# EAGLE schematic axiom_beta_power_board_v0.37_r1.3.ba23fa1e (EAGLE 7.7.0)
Assembly variants: Beta, Min, Tele

## Sheet 1 of 10
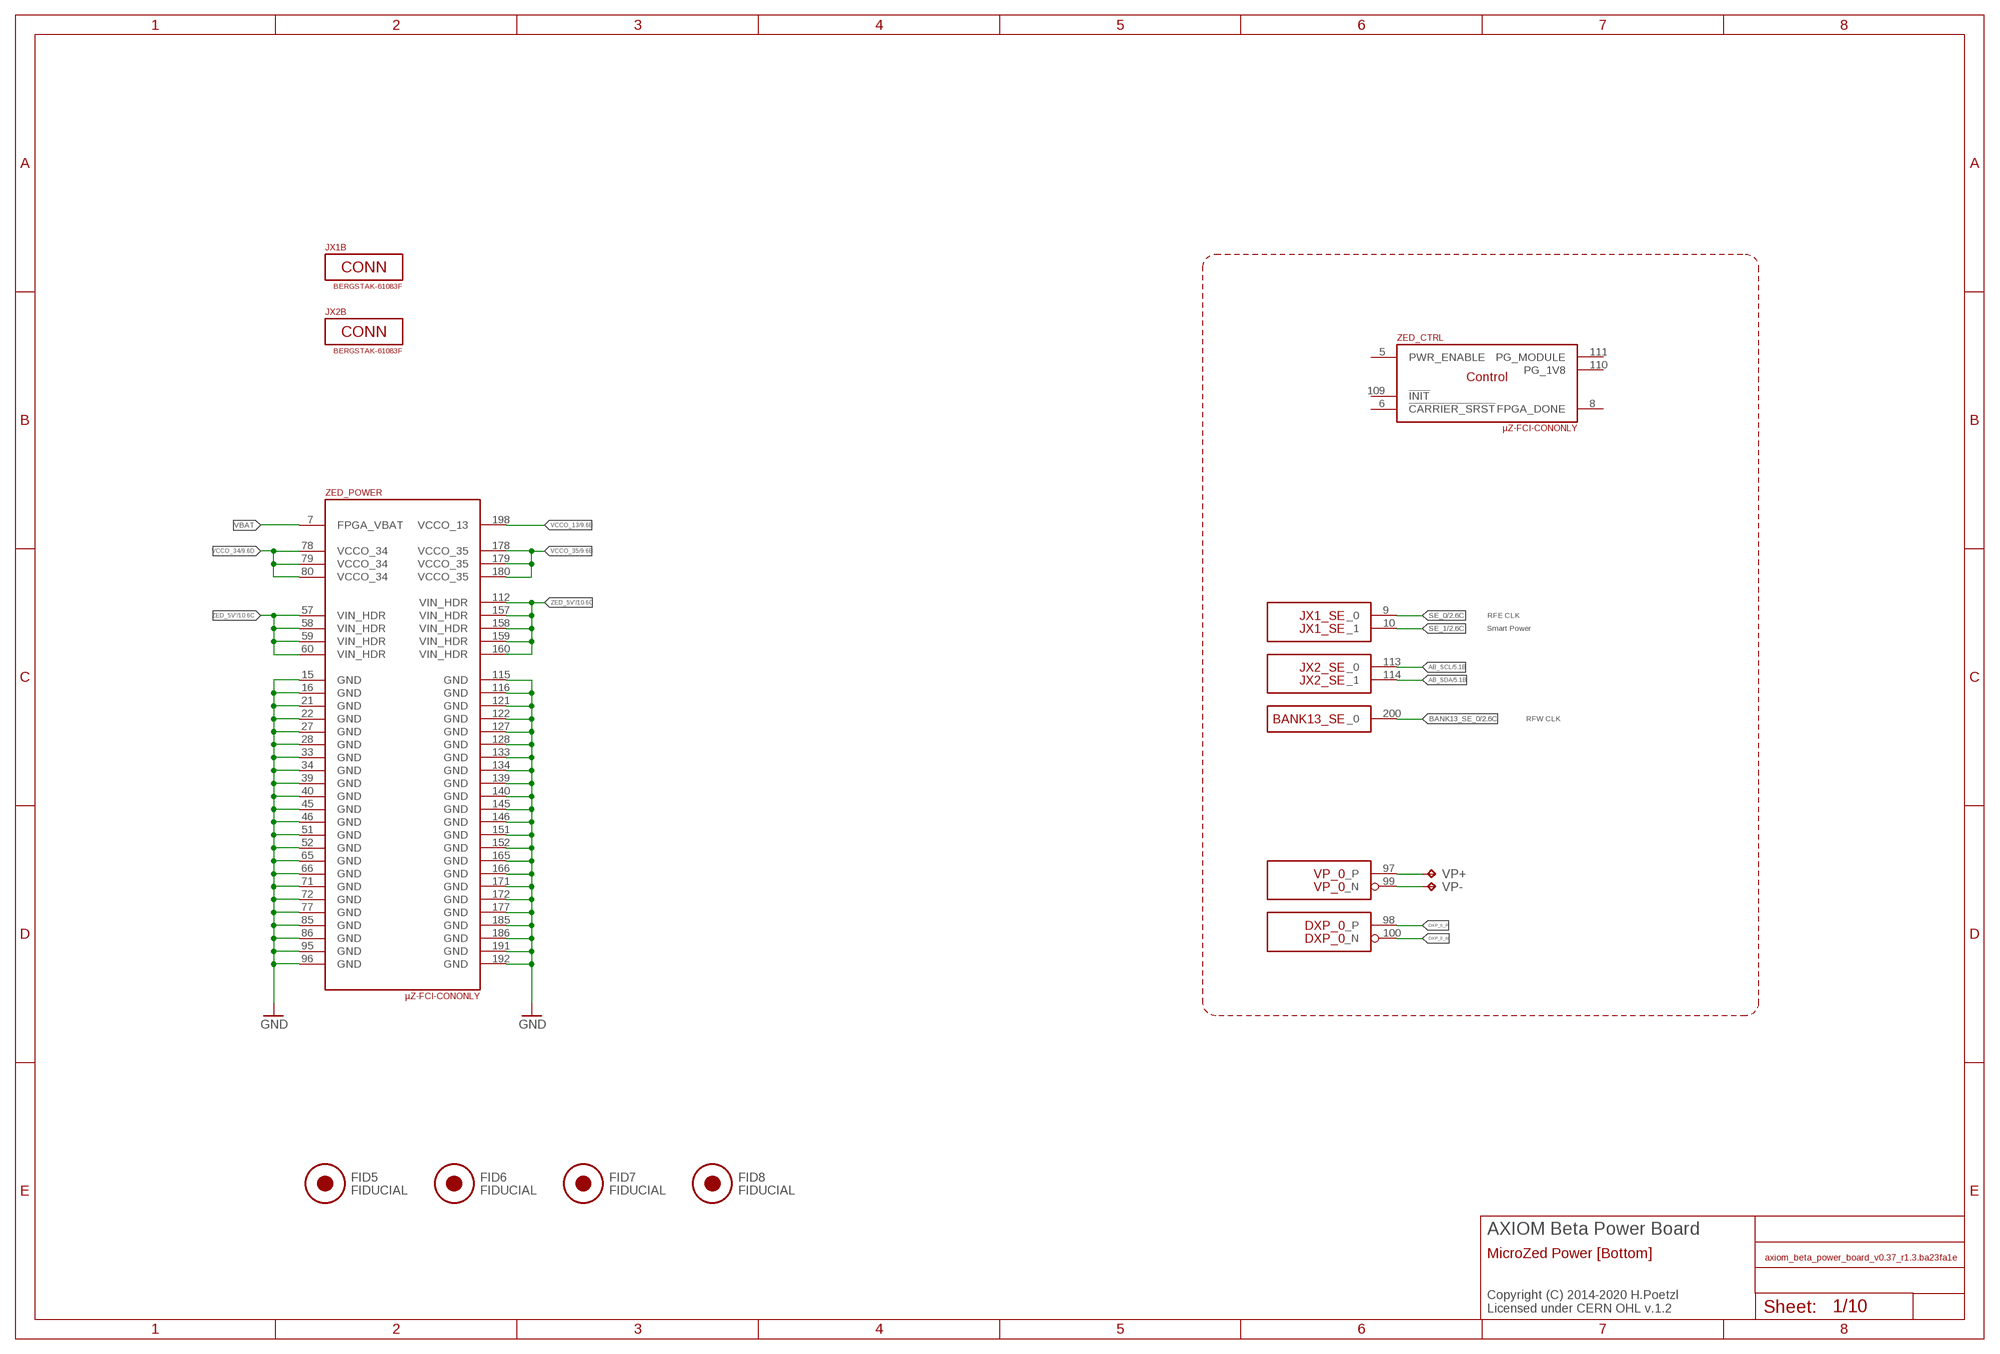
[diagram p0: schematic, sheet 1]

### Parts
FID5  FIDUCIAL  [FID_ARROW]  (not fitted in variant Tele)
FID6  FIDUCIAL  [FID_ARROW]  (not fitted in variant Tele)
FID7  FIDUCIAL  [FID_ARROW]  (not fitted in variant Tele)
FID8  FIDUCIAL  [FID_ARROW]  (not fitted in variant Tele)
JX1B  BERGSTAK-61083F  [61083-FAKE]  (not fitted in variant Beta)  (not fitted in variant Min)
JX2B  BERGSTAK-61083F  [61083-FAKE]  (not fitted in variant Beta)  (not fitted in variant Min)
VP+  TPTP16SQ  [TP16SQ]  (not fitted in variant Tele)
VP-  TPTP16SQ  [TP16SQ]  (not fitted in variant Tele)
ZED  µZ-FCI-CONONLY  [µZ-CONONLY]  (not fitted in variant Tele)

### Nets
AB_SCL: ZED.113(JX2_SE:_0) ; also sheet 5
AB_SDA: ZED.114(JX2_SE:_1) ; also sheet 5
BANK13_SE_0: ZED.200(BANK13_SE:_0) ; also sheet 2
DXP_0_N: ZED.100(DXP_0:_N)
DXP_0_P: ZED.98(DXP_0:_P)
GND: ZED.15(_POWER:GND) ZED.16(_POWER:GND) ZED.21(_POWER:GND) ZED.22(_POWER:GND) ZED.27(_POWER:GND) ZED.28(_POWER:GND) ZED.33(_POWER:GND) ZED.34(_POWER:GND) ZED.39(_POWER:GND) ZED.40(_POWER:GND) ZED.45(_POWER:GND) ZED.46(_POWER:GND) ZED.51(_POWER:GND) ZED.52(_POWER:GND) ZED.65(_POWER:GND) ZED.66(_POWER:GND) ZED.71(_POWER:GND) ZED.72(_POWER:GND) ZED.77(_POWER:GND) ZED.85(_POWER:GND) ZED.86(_POWER:GND) ZED.95(_POWER:GND) ZED.96(_POWER:GND) ZED.115(_POWER:GND) ZED.116(_POWER:GND) ZED.121(_POWER:GND) ZED.122(_POWER:GND) ZED.127(_POWER:GND) ZED.128(_POWER:GND) ZED.133(_POWER:GND) ZED.134(_POWER:GND) ZED.139(_POWER:GND) ZED.140(_POWER:GND) ZED.145(_POWER:GND) ZED.146(_POWER:GND) ZED.151(_POWER:GND) ZED.152(_POWER:GND) ZED.165(_POWER:GND) ZED.166(_POWER:GND) ZED.171(_POWER:GND) ZED.172(_POWER:GND) ZED.177(_POWER:GND) ZED.185(_POWER:GND) ZED.186(_POWER:GND) ZED.191(_POWER:GND) ZED.192(_POWER:GND) ; also sheet 2,3,5,6,7,8,9,10
SE_0: ZED.9(JX1_SE:_0) ; also sheet 2
SE_1: ZED.10(JX1_SE:_1) ; also sheet 2
VBAT: ZED.7(_POWER:FPGA_VBAT)
VCCO_13 [power]: ZED.198(_POWER:VCCO_13) ; also sheet 9
VCCO_34 [power]: ZED.78(_POWER:VCCO_34) ZED.79(_POWER:VCCO_34) ZED.80(_POWER:VCCO_34) ; also sheet 9
VCCO_35 [power]: ZED.178(_POWER:VCCO_35) ZED.179(_POWER:VCCO_35) ZED.180(_POWER:VCCO_35) ; also sheet 9
VP_0_N: VP-.TP ZED.99(VP_0:_N)
VP_0_P: VP+.TP ZED.97(VP_0:_P)
ZED_5V' [power]: ZED.57(_POWER:VIN_HDR) ZED.58(_POWER:VIN_HDR) ZED.59(_POWER:VIN_HDR) ZED.60(_POWER:VIN_HDR) ZED.112(_POWER:VIN_HDR) ZED.157(_POWER:VIN_HDR) ZED.158(_POWER:VIN_HDR) ZED.159(_POWER:VIN_HDR) ZED.160(_POWER:VIN_HDR) ; also sheet 10
Unconnected: ZED.5(_CTRL:PWR_ENABLE) ZED.6(_CTRL:!CARRIER_SRST) ZED.8(_CTRL:FPGA_DONE) ZED.109(_CTRL:!INIT) ZED.110(_CTRL:PG_1V8) ZED.111(_CTRL:PG_MODULE)

### Notes on the sheet
- RFE CLK
- Smart Power
- RFW CLK
- AXIOM Beta Power Board
- MicroZed Power [Bottom]
- Copyright (C) 2014-2020 H.Poetzl
  Licensed under CERN OHL v.1.2

## Sheet 2 of 10
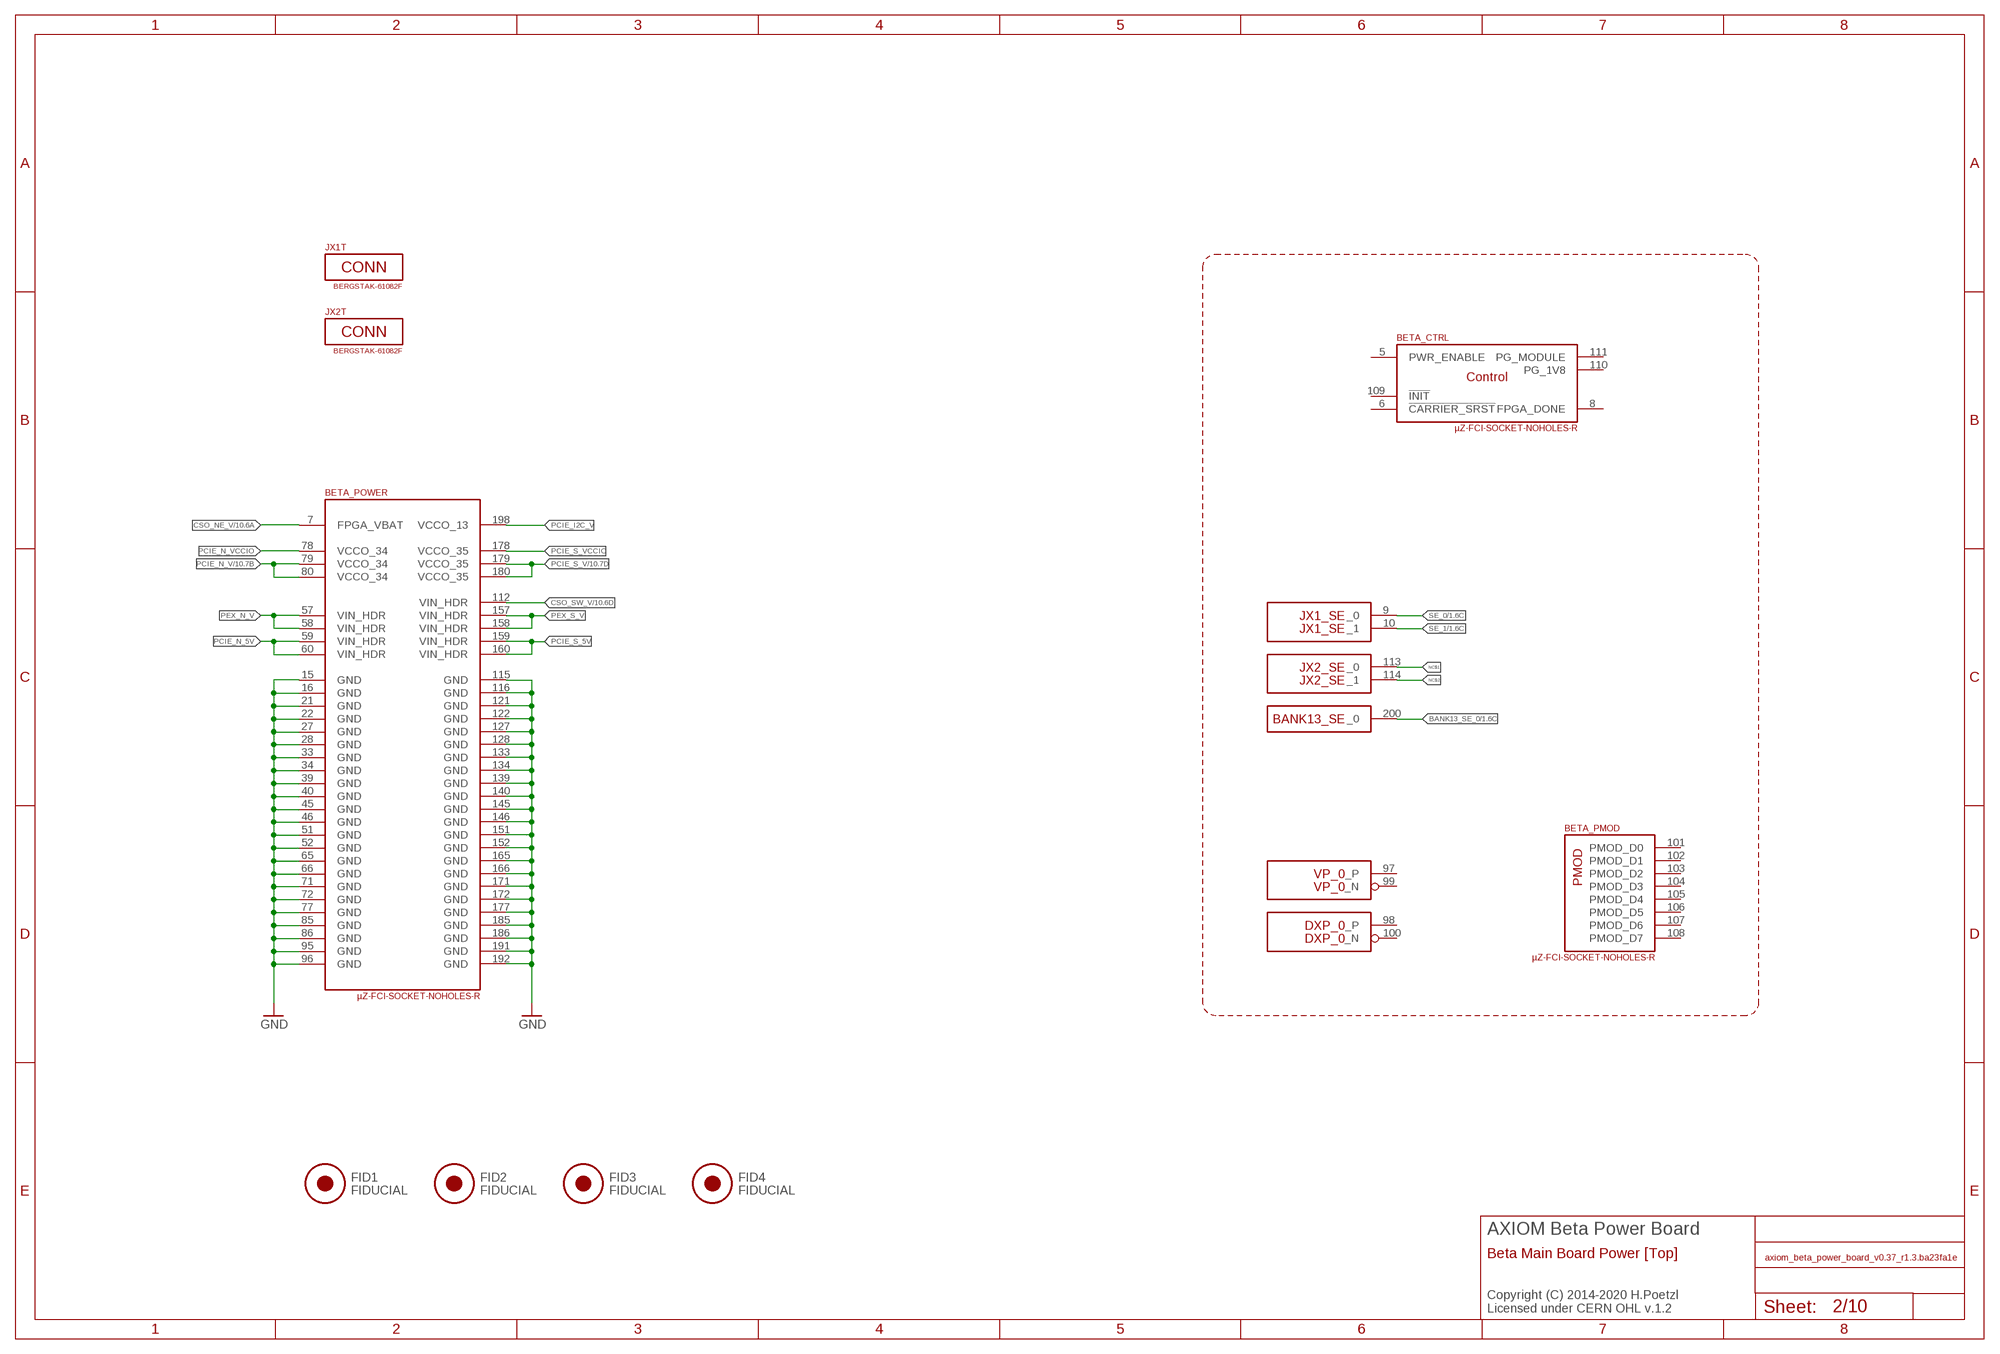
[diagram p1: schematic, sheet 2]

### Parts
BETA  µZ-FCI-SOCKET-NOHOLES-R  [µZ-SOCKET-NOHOLES-R]  (not fitted in variant Tele)
FID1  FIDUCIAL  [FID_ARROW]  (not fitted in variant Tele)
FID2  FIDUCIAL  [FID_ARROW]  (not fitted in variant Tele)
FID3  FIDUCIAL  [FID_ARROW]  (not fitted in variant Tele)
FID4  FIDUCIAL  [FID_ARROW]  (not fitted in variant Tele)
JX1T  BERGSTAK-61082F  [61082-FAKE]  (not fitted in variant Beta)  (not fitted in variant Min)
JX2T  BERGSTAK-61082F  [61082-FAKE]  (not fitted in variant Beta)  (not fitted in variant Min)

### Nets
BANK13_SE_0: BETA.200(BANK13_SE:_0) ; also sheet 1
CSO_NE_V [power]: BETA.7(_POWER:FPGA_VBAT) ; also sheet 10
CSO_SW_V [power]: BETA.112(_POWER:VIN_HDR) ; also sheet 10
GND: BETA.15(_POWER:GND) BETA.16(_POWER:GND) BETA.21(_POWER:GND) BETA.22(_POWER:GND) BETA.27(_POWER:GND) BETA.28(_POWER:GND) BETA.33(_POWER:GND) BETA.34(_POWER:GND) BETA.39(_POWER:GND) BETA.40(_POWER:GND) BETA.45(_POWER:GND) BETA.46(_POWER:GND) BETA.51(_POWER:GND) BETA.52(_POWER:GND) BETA.65(_POWER:GND) BETA.66(_POWER:GND) BETA.71(_POWER:GND) BETA.72(_POWER:GND) BETA.77(_POWER:GND) BETA.85(_POWER:GND) BETA.86(_POWER:GND) BETA.95(_POWER:GND) BETA.96(_POWER:GND) BETA.115(_POWER:GND) BETA.116(_POWER:GND) BETA.121(_POWER:GND) BETA.122(_POWER:GND) BETA.127(_POWER:GND) BETA.128(_POWER:GND) BETA.133(_POWER:GND) BETA.134(_POWER:GND) BETA.139(_POWER:GND) BETA.140(_POWER:GND) BETA.145(_POWER:GND) BETA.146(_POWER:GND) BETA.151(_POWER:GND) BETA.152(_POWER:GND) BETA.165(_POWER:GND) BETA.166(_POWER:GND) BETA.171(_POWER:GND) BETA.172(_POWER:GND) BETA.177(_POWER:GND) BETA.185(_POWER:GND) BETA.186(_POWER:GND) BETA.191(_POWER:GND) BETA.192(_POWER:GND) ; also sheet 1,3,5,6,7,8,9,10
NC$1 [LVDS]: BETA.113(JX2_SE:_0)
NC$2 [LVDS]: BETA.114(JX2_SE:_1)
PCIE_I2C_V [power]: BETA.198(_POWER:VCCO_13)
PCIE_N_5V: BETA.59(_POWER:VIN_HDR) BETA.60(_POWER:VIN_HDR)
PCIE_N_V [power]: BETA.79(_POWER:VCCO_34) BETA.80(_POWER:VCCO_34) ; also sheet 10
PCIE_N_VCCIO [power]: BETA.78(_POWER:VCCO_34)
PCIE_S_5V [power]: BETA.159(_POWER:VIN_HDR) BETA.160(_POWER:VIN_HDR)
PCIE_S_V [power]: BETA.179(_POWER:VCCO_35) BETA.180(_POWER:VCCO_35) ; also sheet 10
PCIE_S_VCCIO [power]: BETA.178(_POWER:VCCO_35)
PEX_N_V: BETA.57(_POWER:VIN_HDR) BETA.58(_POWER:VIN_HDR)
PEX_S_V [power]: BETA.157(_POWER:VIN_HDR) BETA.158(_POWER:VIN_HDR)
SE_0: BETA.9(JX1_SE:_0) ; also sheet 1
SE_1: BETA.10(JX1_SE:_1) ; also sheet 1
Unconnected: BETA.5(_CTRL:PWR_ENABLE) BETA.6(_CTRL:!CARRIER_SRST) BETA.8(_CTRL:FPGA_DONE) BETA.97(VP_0:_P) BETA.98(DXP_0:_P) BETA.99(VP_0:_N) BETA.100(DXP_0:_N) BETA.101(_PMOD:PMOD_D0) BETA.102(_PMOD:PMOD_D1) BETA.103(_PMOD:PMOD_D2) BETA.104(_PMOD:PMOD_D3) BETA.105(_PMOD:PMOD_D4) BETA.106(_PMOD:PMOD_D5) BETA.107(_PMOD:PMOD_D6) BETA.108(_PMOD:PMOD_D7) BETA.109(_CTRL:!INIT) BETA.110(_CTRL:PG_1V8) BETA.111(_CTRL:PG_MODULE)

### Notes on the sheet
- AXIOM Beta Power Board
- Beta Main Board Power [Top]
- Copyright (C) 2014-2020 H.Poetzl
  Licensed under CERN OHL v.1.2

## Sheet 3 of 10
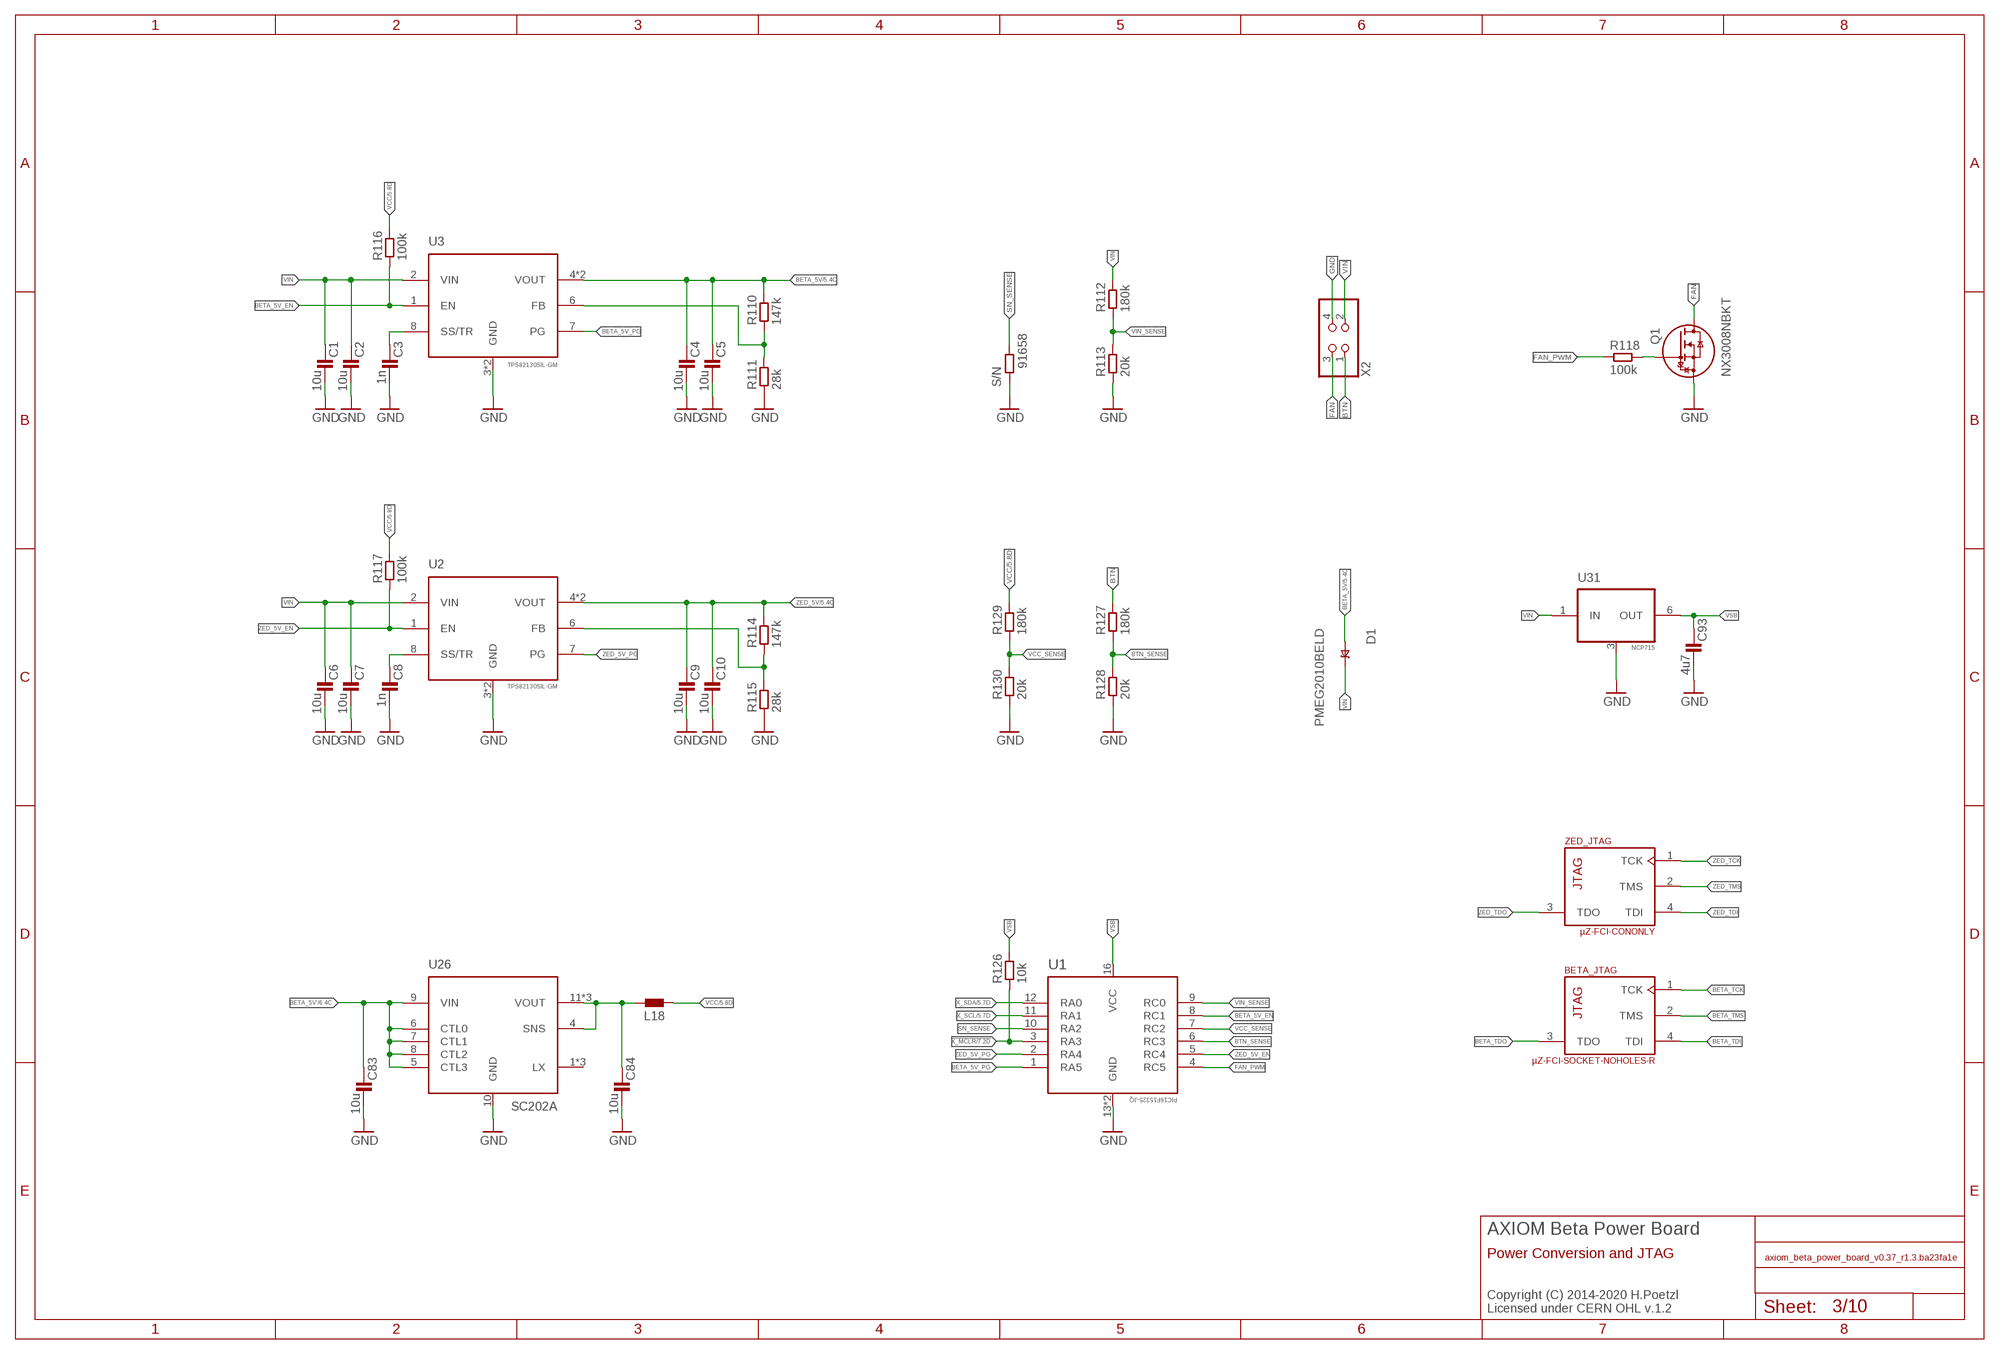
[diagram p2: schematic, sheet 3]

### Parts
C1  10u  C0603-B  [0603-B]
C2  10u  C1206-C  [1206-C]
C3  1n  C0402-C  [0402-C]
C4  10u  C1206-C  [1206-C]
C5  10u  C0603-B  [0603-B]
C6  10u  C0603-B  [0603-B]
C7  10u  C1206-C  [1206-C]
C8  1n  C0402-C  [0402-C]
C9  10u  C1206-C  [1206-C]
C10  10u  C0603-B  [0603-B]
C83  10u  C0603-C  [0603-C]
C84  10u  C0603-C  [0603-C]
C93  4u7  C0402-B  [0402-B]
D1  PMEG2010BELD  [DFN1006D-2]
L18  L0603-C  [0603-C]
Q1  NX3008NBKT  [SOT416]
R110  147k  R0402-C  [0402-C]
R111  28k  R0402-C  [0402-C]
R112  180k  R0402-B  [0402-B]
R113  20k  R0402-B  [0402-B]
R114  147k  R0402-C  [0402-C]
R115  28k  R0402-C  [0402-C]
R116  100k  R0402-B  [0402-B]
R117  100k  R0402-B  [0402-B]
R118  100k  R0402-C  [0402-C]
R126  10k  R0402-B  [0402-B]
R127  180k  R0402-C  [0402-C]
R128  20k  R0402-C  [0402-C]
R129  180k  R0402-C  [0402-C]
R130  20k  R0402-C  [0402-C]
S/N  91658  [3X2MM]
U1  PIC16F15325-JQ  [UQFN65P400X400X100-17N]
U2  TPS82130SIL-GM  [SIL0008D-GM]
U3  TPS82130SIL-GM  [SIL0008D-GM]
U26  SC202A  [MLPQ-13]
U31  NCP715  [DFN150X150X50-6N]
X2  PINHD-2X02_2.54-90°  [2X02/90]

### Nets
!X_MCLR: R126.2 U1.3(RA3) ; also sheet 7
BETA_5V [power]: C4.1 C5.1 D1.A R110.1 U3.4(VOUT) U3.5(VOUT) ; also sheet 5,10
BETA_5V' [power]: C83.1 U26.5(CTL3) U26.6(CTL0) U26.7(CTL1) U26.8(CTL2) U26.9(VIN) ; also sheet 6,7,8,10
BETA_5V_EN: R116.2 U1.8(RC1) U3.1(EN)
BETA_5V_PG: U1.1(RA5) U3.7(PG)
BETA_TCK: BETA.1(_JTAG:TCK)
BETA_TDI: BETA.4(_JTAG:TDI)
BETA_TDO: BETA.3(_JTAG:TDO)
BETA_TMS: BETA.2(_JTAG:TMS)
BTN: R127.1 X2.1
BTN_SENSE: R127.2 R128.1 U1.6(RC3)
FAN: Q1.3(D) X2.3
FAN_PWM: R118.2 U1.4(RC5)
GND: C1.2 C2.2 C3.2 C4.2 C5.2 C6.2 C7.2 C8.2 C9.2 C10.2 C83.2 C84.2 C93.2 Q1.2(S) R111.2 R113.2 R115.2 R128.2 R130.2 S/N.1 U1.13(GND) U1.EP(GND) U2.3(GND) U2.EPAD(GND) U3.3(GND) U3.EPAD(GND) U26.10(GND) U31.3(GND) X2.4 ; also sheet 1,2,5,6,7,8,9,10
N$2: C8.1 U2.8(SS/TR)
N$8: C3.1 U3.8(SS/TR)
N$14: Q1.1(G) R118.1
N$15: R110.2 R111.1 U3.6(FB)
N$19: R114.2 R115.1 U2.6(FB)
REGOUT [power]: C84.1 L18.1 U26.4(SNS) U26.11(VOUT) U26.12(VOUT) U26.13(VOUT)
SN_SENSE: S/N.2 U1.10(RA2)
VCC [power]: L18.2 R116.1 R117.1 R129.1 ; also sheet 5,6,7,8,9,10
VCC_SENSE: R129.2 R130.1 U1.7(RC2)
VIN [power]: C1.1 C2.1 C6.1 C7.1 D1.C(K) R112.1 U2.2(VIN) U3.2(VIN) U31.1(IN) X2.2
VIN_SENSE: R112.2 R113.1 U1.9(RC0)
VSB: C93.1 R126.1 U1.16(VCC) U31.6(OUT) ; also sheet 5
X_SCL: U1.11(RA1) ; also sheet 5
X_SDA: U1.12(RA0) ; also sheet 5
ZED_5V [power]: C9.1 C10.1 R114.1 U2.4(VOUT) U2.5(VOUT) ; also sheet 5,10
ZED_5V_EN: R117.2 U1.5(RC4) U2.1(EN)
ZED_5V_PG: U1.2(RA4) U2.7(PG)
ZED_TCK: ZED.1(_JTAG:TCK)
ZED_TDI: ZED.4(_JTAG:TDI)
ZED_TDO: ZED.3(_JTAG:TDO)
ZED_TMS: ZED.2(_JTAG:TMS)
Unconnected: U26.1(LX) U26.2(LX) U26.3(LX)

### Notes on the sheet
- AXIOM Beta Power Board
- Power Conversion and JTAG
- Copyright (C) 2014-2020 H.Poetzl
  Licensed under CERN OHL v.1.2

## Sheet 4 of 10
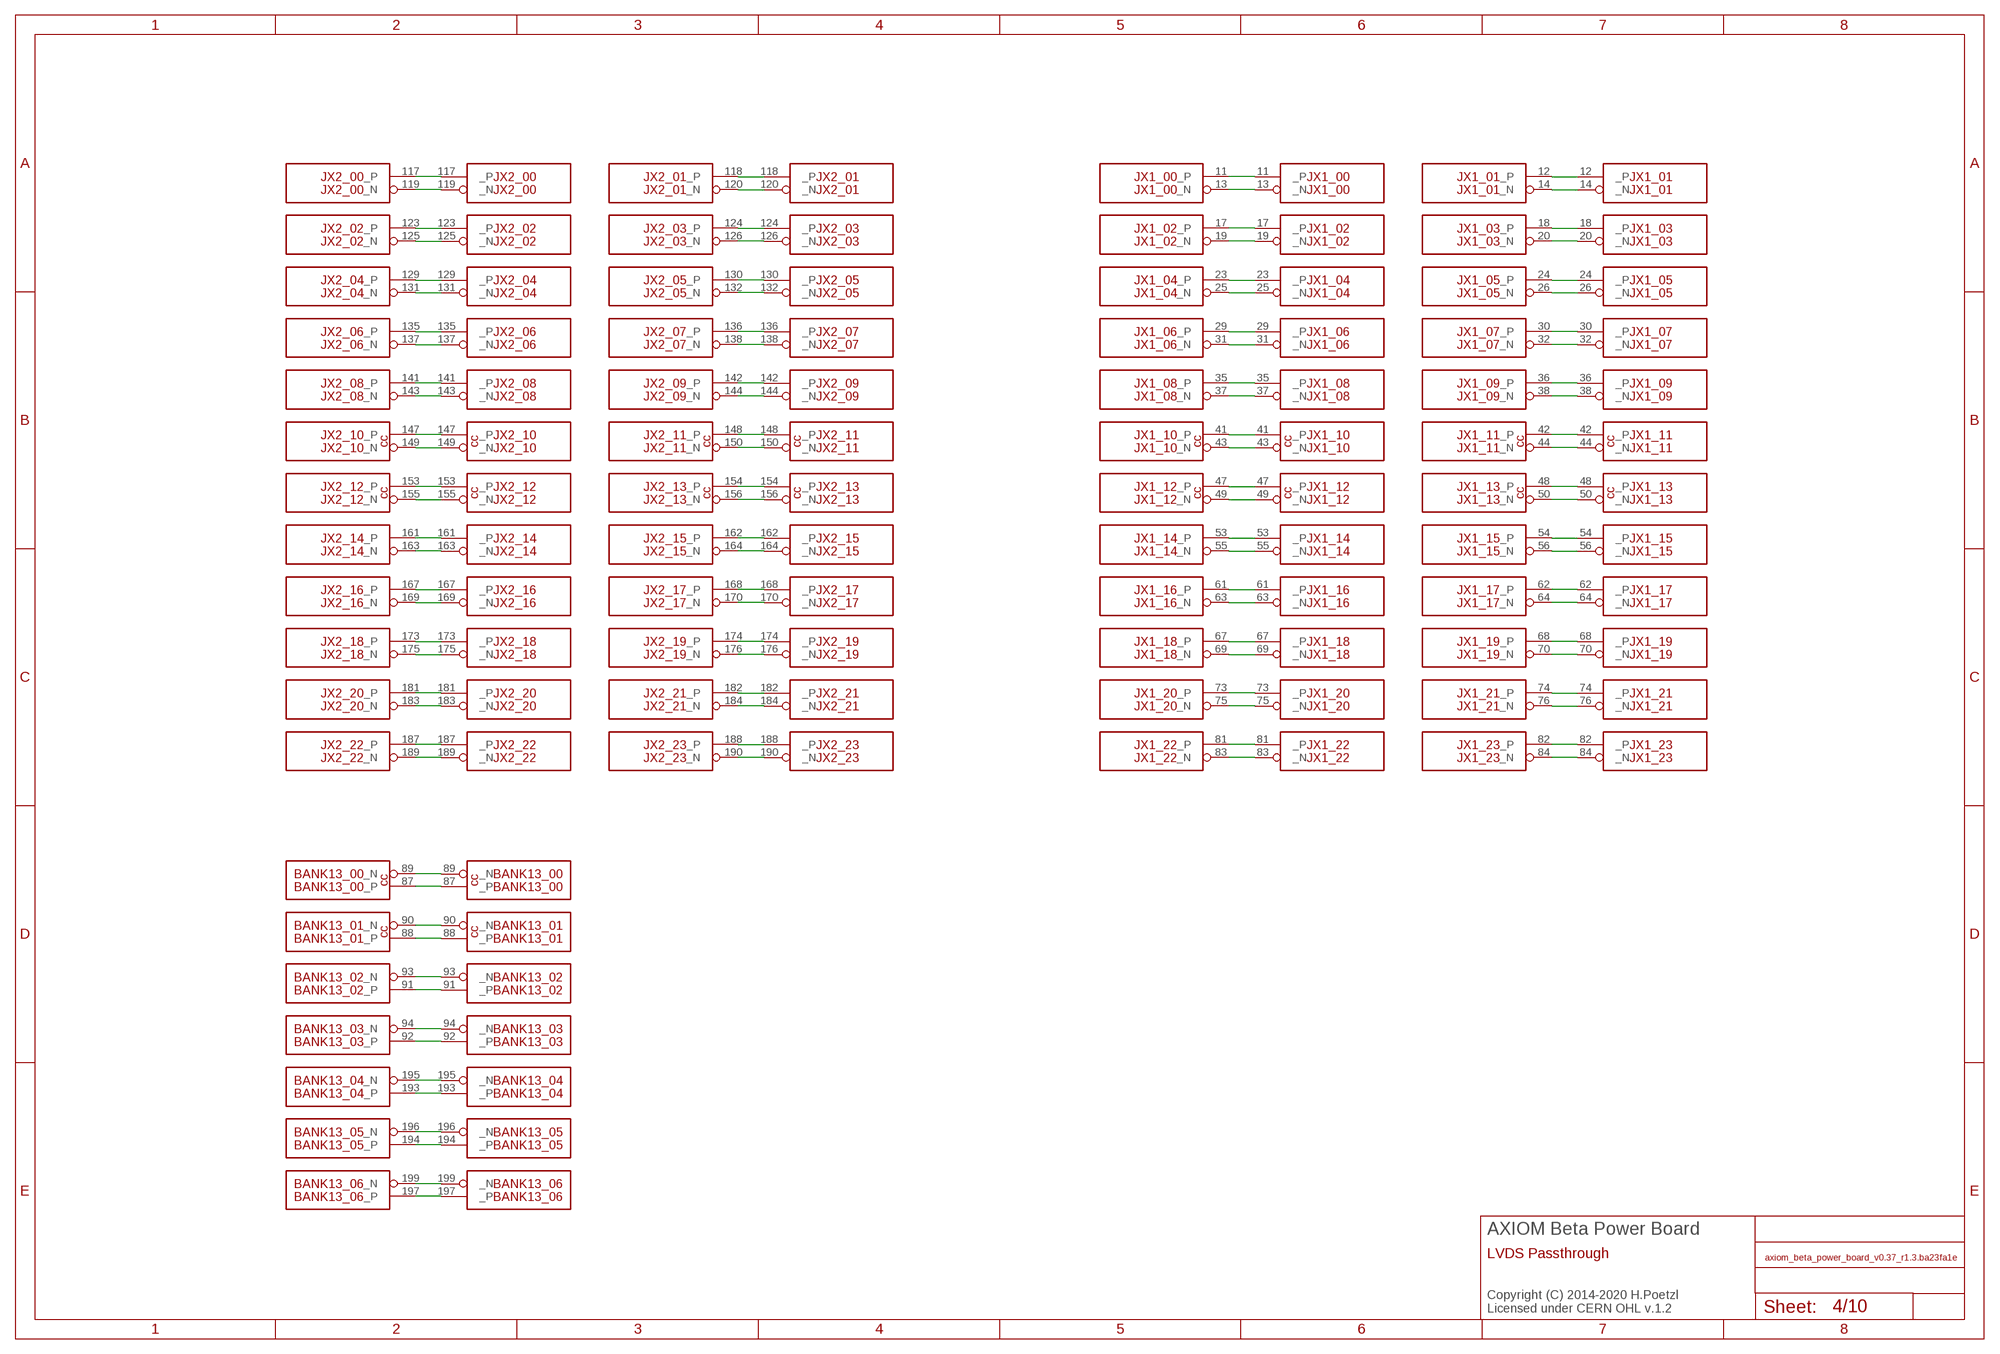
[diagram p3: schematic, sheet 4]

### Nets
BANK13_00_N [LVDS]: BETA.89(BANK13_00:_N) ZED.89(BANK13_00:_N)
BANK13_00_P [LVDS]: BETA.87(BANK13_00:_P) ZED.87(BANK13_00:_P)
BANK13_01_N [LVDS]: BETA.90(BANK13_01:_N) ZED.90(BANK13_01:_N)
BANK13_01_P [LVDS]: BETA.88(BANK13_01:_P) ZED.88(BANK13_01:_P)
BANK13_02_N [LVDS]: BETA.93(BANK13_02:_N) ZED.93(BANK13_02:_N)
BANK13_02_P [LVDS]: BETA.91(BANK13_02:_P) ZED.91(BANK13_02:_P)
BANK13_03_N [LVDS]: BETA.94(BANK13_03:_N) ZED.94(BANK13_03:_N)
BANK13_03_P [LVDS]: BETA.92(BANK13_03:_P) ZED.92(BANK13_03:_P)
BANK13_04_N [LVDS]: BETA.195(BANK13_04:_N) ZED.195(BANK13_04:_N)
BANK13_04_P [LVDS]: BETA.193(BANK13_04:_P) ZED.193(BANK13_04:_P)
BANK13_05_N: BETA.196(BANK13_05:_N) ZED.196(BANK13_05:_N)
BANK13_05_P: BETA.194(BANK13_05:_P) ZED.194(BANK13_05:_P)
BANK13_06_N [LVDS]: BETA.199(BANK13_06:_N) ZED.199(BANK13_06:_N)
BANK13_06_P [LVDS]: BETA.197(BANK13_06:_P) ZED.197(BANK13_06:_P)
JX1_00_N [LVDS]: BETA.13(JX1_00:_N) ZED.13(JX1_00:_N)
JX1_00_P [LVDS]: BETA.11(JX1_00:_P) ZED.11(JX1_00:_P)
JX1_01_N [LVDS]: BETA.14(JX1_01:_N) ZED.14(JX1_01:_N)
JX1_01_P [LVDS]: BETA.12(JX1_01:_P) ZED.12(JX1_01:_P)
JX1_02_N [LVDS]: BETA.19(JX1_02:_N) ZED.19(JX1_02:_N)
JX1_02_P [LVDS]: BETA.17(JX1_02:_P) ZED.17(JX1_02:_P)
JX1_03_N [LVDS]: BETA.20(JX1_03:_N) ZED.20(JX1_03:_N)
JX1_03_P [LVDS]: BETA.18(JX1_03:_P) ZED.18(JX1_03:_P)
JX1_04_N [LVDS]: BETA.25(JX1_04:_N) ZED.25(JX1_04:_N)
JX1_04_P [LVDS]: BETA.23(JX1_04:_P) ZED.23(JX1_04:_P)
JX1_05_N: BETA.26(JX1_05:_N) ZED.26(JX1_05:_N)
JX1_05_P: BETA.24(JX1_05:_P) ZED.24(JX1_05:_P)
JX1_06_N [LVDS]: BETA.31(JX1_06:_N) ZED.31(JX1_06:_N)
JX1_06_P [LVDS]: BETA.29(JX1_06:_P) ZED.29(JX1_06:_P)
JX1_07_N [LVDS]: BETA.32(JX1_07:_N) ZED.32(JX1_07:_N)
JX1_07_P [LVDS]: BETA.30(JX1_07:_P) ZED.30(JX1_07:_P)
JX1_08_N: BETA.37(JX1_08:_N) ZED.37(JX1_08:_N)
JX1_08_P: BETA.35(JX1_08:_P) ZED.35(JX1_08:_P)
JX1_09_N [LVDS]: BETA.38(JX1_09:_N) ZED.38(JX1_09:_N)
JX1_09_P [LVDS]: BETA.36(JX1_09:_P) ZED.36(JX1_09:_P)
JX1_10_N [LVDS]: BETA.43(JX1_10:_N) ZED.43(JX1_10:_N)
JX1_10_P [LVDS]: BETA.41(JX1_10:_P) ZED.41(JX1_10:_P)
JX1_11_N [LVDS]: BETA.44(JX1_11:_N) ZED.44(JX1_11:_N)
JX1_11_P [LVDS]: BETA.42(JX1_11:_P) ZED.42(JX1_11:_P)
JX1_12_N [LVDS]: BETA.49(JX1_12:_N) ZED.49(JX1_12:_N)
JX1_12_P [LVDS]: BETA.47(JX1_12:_P) ZED.47(JX1_12:_P)
JX1_13_N [LVDS]: BETA.50(JX1_13:_N) ZED.50(JX1_13:_N)
JX1_13_P [LVDS]: BETA.48(JX1_13:_P) ZED.48(JX1_13:_P)
JX1_14_N [LVDS]: BETA.55(JX1_14:_N) ZED.55(JX1_14:_N)
JX1_14_P [LVDS]: BETA.53(JX1_14:_P) ZED.53(JX1_14:_P)
JX1_15_N: BETA.56(JX1_15:_N) ZED.56(JX1_15:_N)
JX1_15_P: BETA.54(JX1_15:_P) ZED.54(JX1_15:_P)
JX1_16_N [LVDS]: BETA.63(JX1_16:_N) ZED.63(JX1_16:_N)
JX1_16_P [LVDS]: BETA.61(JX1_16:_P) ZED.61(JX1_16:_P)
JX1_17_N [LVDS]: BETA.64(JX1_17:_N) ZED.64(JX1_17:_N)
JX1_17_P [LVDS]: BETA.62(JX1_17:_P) ZED.62(JX1_17:_P)
JX1_18_N [LVDS]: BETA.69(JX1_18:_N) ZED.69(JX1_18:_N)
JX1_18_P [LVDS]: BETA.67(JX1_18:_P) ZED.67(JX1_18:_P)
JX1_19_N [LVDS]: BETA.70(JX1_19:_N) ZED.70(JX1_19:_N)
JX1_19_P [LVDS]: BETA.68(JX1_19:_P) ZED.68(JX1_19:_P)
JX1_20_N: BETA.75(JX1_20:_N) ZED.75(JX1_20:_N)
JX1_20_P: BETA.73(JX1_20:_P) ZED.73(JX1_20:_P)
JX1_21_N: BETA.76(JX1_21:_N) ZED.76(JX1_21:_N)
JX1_21_P: BETA.74(JX1_21:_P) ZED.74(JX1_21:_P)
JX1_22_N: BETA.83(JX1_22:_N) ZED.83(JX1_22:_N)
JX1_22_P: BETA.81(JX1_22:_P) ZED.81(JX1_22:_P)
JX1_23_N [LVDS]: BETA.84(JX1_23:_N) ZED.84(JX1_23:_N)
JX1_23_P [LVDS]: BETA.82(JX1_23:_P) ZED.82(JX1_23:_P)
JX2_00_N [LVDS]: BETA.119(JX2_00:_N) ZED.119(JX2_00:_N)
JX2_00_P [LVDS]: BETA.117(JX2_00:_P) ZED.117(JX2_00:_P)
JX2_01_N [LVDS]: BETA.120(JX2_01:_N) ZED.120(JX2_01:_N)
JX2_01_P [LVDS]: BETA.118(JX2_01:_P) ZED.118(JX2_01:_P)
JX2_02_N [LVDS]: BETA.125(JX2_02:_N) ZED.125(JX2_02:_N)
JX2_02_P [LVDS]: BETA.123(JX2_02:_P) ZED.123(JX2_02:_P)
JX2_03_N [LVDS]: BETA.126(JX2_03:_N) ZED.126(JX2_03:_N)
JX2_03_P [LVDS]: BETA.124(JX2_03:_P) ZED.124(JX2_03:_P)
JX2_04_N [LVDS]: BETA.131(JX2_04:_N) ZED.131(JX2_04:_N)
JX2_04_P [LVDS]: BETA.129(JX2_04:_P) ZED.129(JX2_04:_P)
JX2_05_N [LVDS]: BETA.132(JX2_05:_N) ZED.132(JX2_05:_N)
JX2_05_P [LVDS]: BETA.130(JX2_05:_P) ZED.130(JX2_05:_P)
JX2_06_N [LVDS]: BETA.137(JX2_06:_N) ZED.137(JX2_06:_N)
JX2_06_P [LVDS]: BETA.135(JX2_06:_P) ZED.135(JX2_06:_P)
JX2_07_N [LVDS]: BETA.138(JX2_07:_N) ZED.138(JX2_07:_N)
JX2_07_P [LVDS]: BETA.136(JX2_07:_P) ZED.136(JX2_07:_P)
JX2_08_N [LVDS]: BETA.143(JX2_08:_N) ZED.143(JX2_08:_N)
JX2_08_P [LVDS]: BETA.141(JX2_08:_P) ZED.141(JX2_08:_P)
JX2_09_N [LVDS]: BETA.144(JX2_09:_N) ZED.144(JX2_09:_N)
JX2_09_P [LVDS]: BETA.142(JX2_09:_P) ZED.142(JX2_09:_P)
JX2_10_N [LVDS]: BETA.149(JX2_10:_N) ZED.149(JX2_10:_N)
JX2_10_P [LVDS]: BETA.147(JX2_10:_P) ZED.147(JX2_10:_P)
JX2_11_N [LVDS]: BETA.150(JX2_11:_N) ZED.150(JX2_11:_N)
JX2_11_P [LVDS]: BETA.148(JX2_11:_P) ZED.148(JX2_11:_P)
JX2_12_N [LVDS]: BETA.155(JX2_12:_N) ZED.155(JX2_12:_N)
JX2_12_P [LVDS]: BETA.153(JX2_12:_P) ZED.153(JX2_12:_P)
JX2_13_N [LVDS]: BETA.156(JX2_13:_N) ZED.156(JX2_13:_N)
JX2_13_P [LVDS]: BETA.154(JX2_13:_P) ZED.154(JX2_13:_P)
JX2_14_N: BETA.163(JX2_14:_N) ZED.163(JX2_14:_N)
JX2_14_P: BETA.161(JX2_14:_P) ZED.161(JX2_14:_P)
JX2_15_N [LVDS]: BETA.164(JX2_15:_N) ZED.164(JX2_15:_N)
JX2_15_P [LVDS]: BETA.162(JX2_15:_P) ZED.162(JX2_15:_P)
JX2_16_N [LVDS]: BETA.169(JX2_16:_N) ZED.169(JX2_16:_N)
JX2_16_P [LVDS]: BETA.167(JX2_16:_P) ZED.167(JX2_16:_P)
JX2_17_N [LVDS]: BETA.170(JX2_17:_N) ZED.170(JX2_17:_N)
JX2_17_P [LVDS]: BETA.168(JX2_17:_P) ZED.168(JX2_17:_P)
JX2_18_N [LVDS]: BETA.175(JX2_18:_N) ZED.175(JX2_18:_N)
JX2_18_P [LVDS]: BETA.173(JX2_18:_P) ZED.173(JX2_18:_P)
JX2_19_N [LVDS]: BETA.176(JX2_19:_N) ZED.176(JX2_19:_N)
JX2_19_P [LVDS]: BETA.174(JX2_19:_P) ZED.174(JX2_19:_P)
JX2_20_N [LVDS]: BETA.183(JX2_20:_N) ZED.183(JX2_20:_N)
JX2_20_P [LVDS]: BETA.181(JX2_20:_P) ZED.181(JX2_20:_P)
JX2_21_N [LVDS]: BETA.184(JX2_21:_N) ZED.184(JX2_21:_N)
JX2_21_P [LVDS]: BETA.182(JX2_21:_P) ZED.182(JX2_21:_P)
JX2_22_N: BETA.189(JX2_22:_N) ZED.189(JX2_22:_N)
JX2_22_P: BETA.187(JX2_22:_P) ZED.187(JX2_22:_P)
JX2_23_N [LVDS]: BETA.190(JX2_23:_N) ZED.190(JX2_23:_N)
JX2_23_P [LVDS]: BETA.188(JX2_23:_P) ZED.188(JX2_23:_P)

### Notes on the sheet
- AXIOM Beta Power Board
- LVDS Passthrough
- Copyright (C) 2014-2020 H.Poetzl
  Licensed under CERN OHL v.1.2

## Sheet 5 of 10
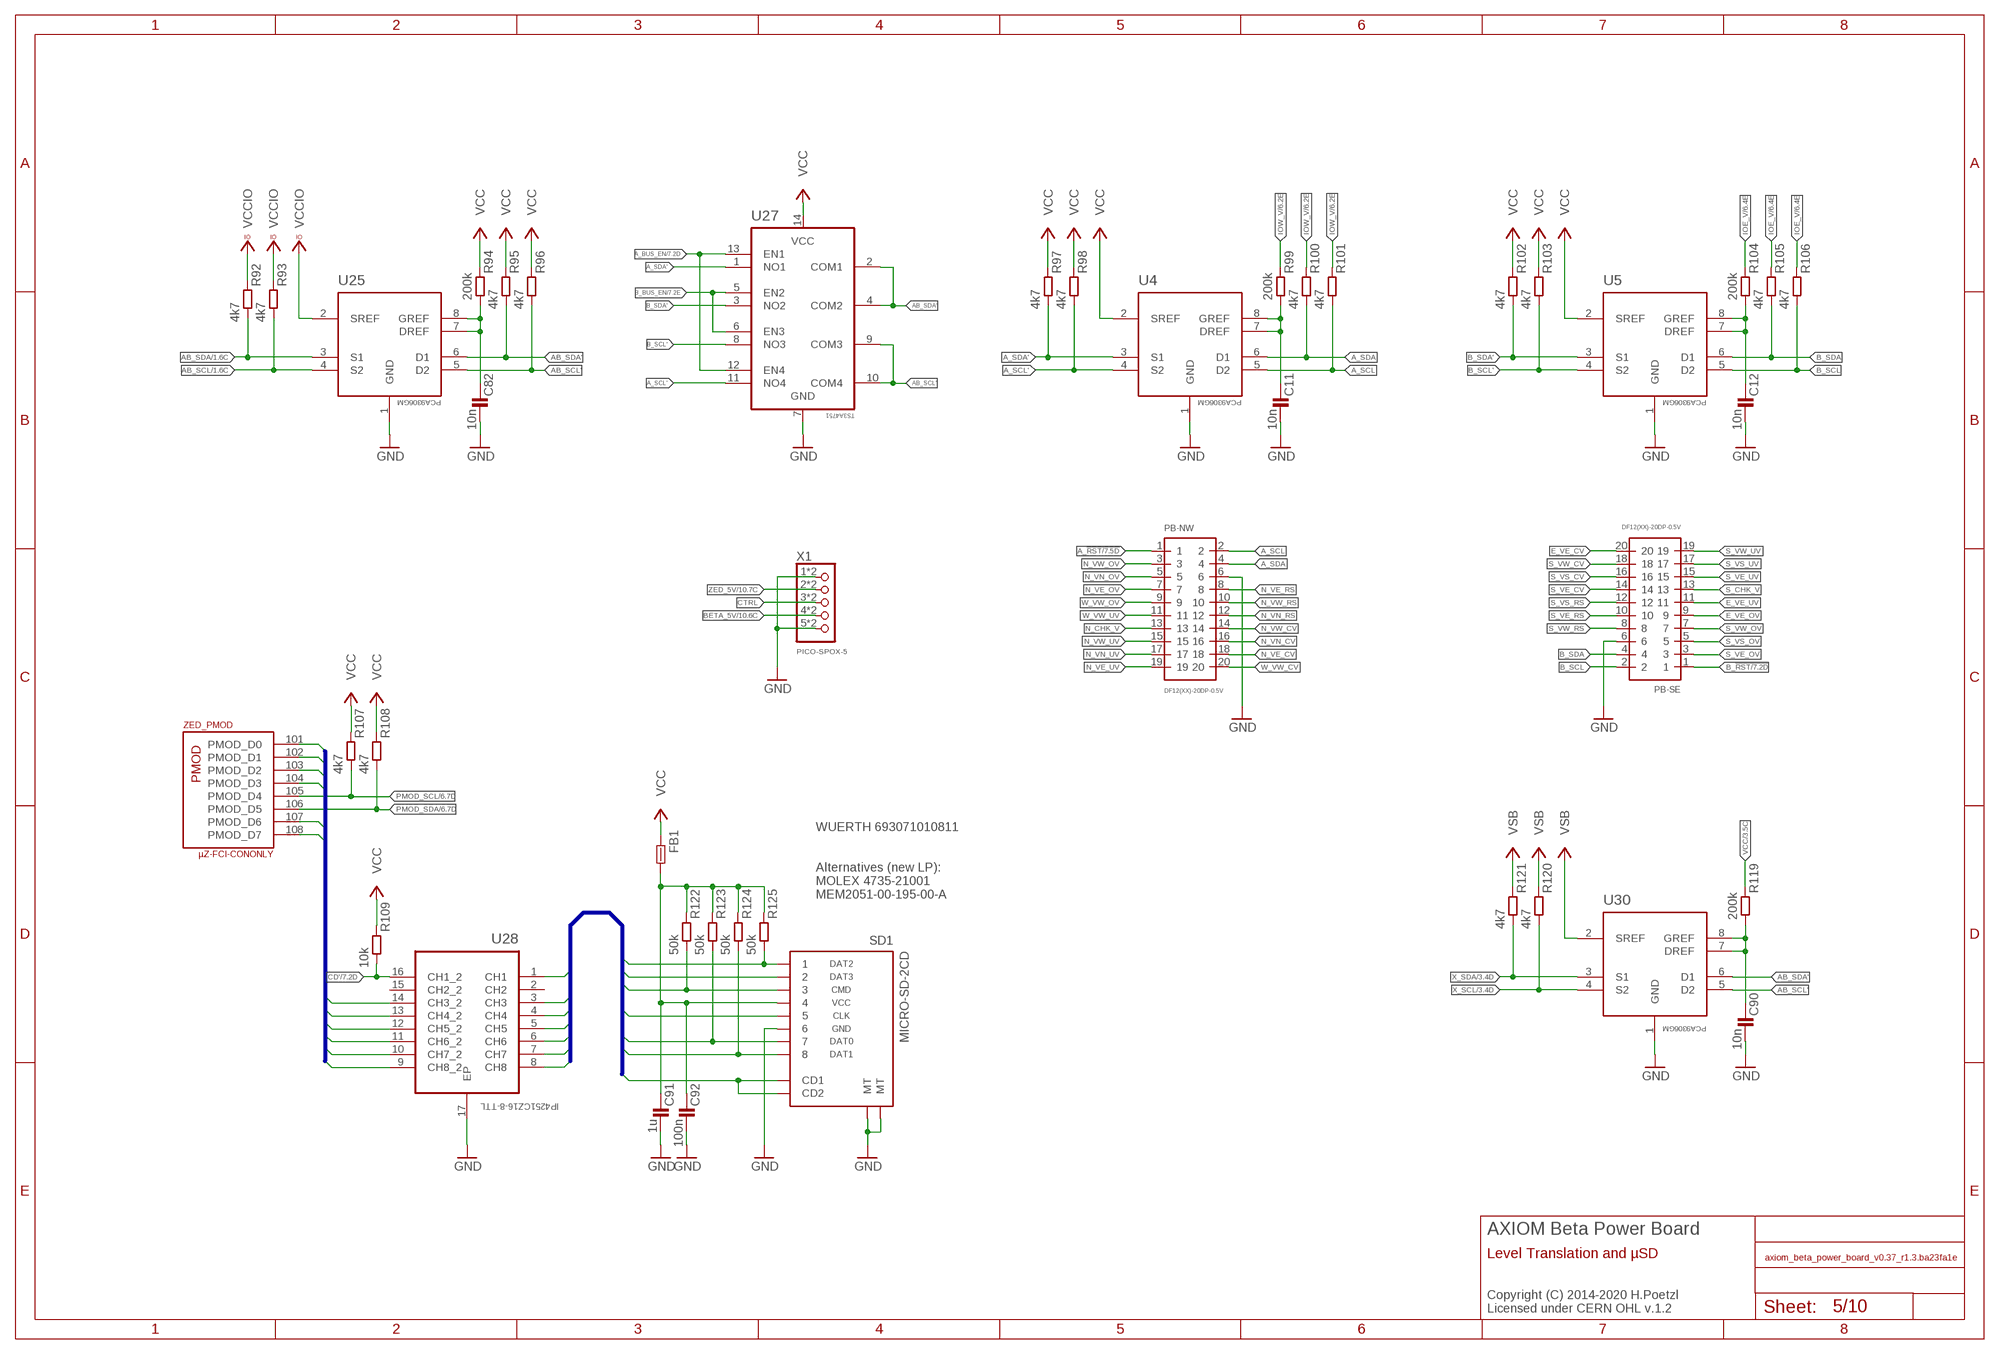
[diagram p4: schematic, sheet 5]

### Parts
C11  10n  C0402-B  [0402-B]
C12  10n  C0402-B  [0402-B]
C82  10n  C0402-B  [0402-B]
C90  10n  C0402-B  [0402-B]
C91  1u  C0402-B  [0402-B]
C92  100n  C0402-B  [0402-B]
FB1  FB0402-B  [0402-B]
PB-NW  DF12(XX)-20DP-0.5V  [DF12(XX)-20DP-0.5V]
PB-SE  DF12(XX)-20DP-0.5V  [DF12(XX)-20DP-0.5V]
R92  4k7  R0402-B  [0402-B]
R93  4k7  R0402-B  [0402-B]
R94  200k  R0402-B  [0402-B]
R95  4k7  R0402-B  [0402-B]
R96  4k7  R0402-B  [0402-B]
R97  4k7  R0402-B  [0402-B]
R98  4k7  R0402-B  [0402-B]
R99  200k  R0402-B  [0402-B]
R100  4k7  R0402-B  [0402-B]
R101  4k7  R0402-B  [0402-B]
R102  4k7  R0402-B  [0402-B]
R103  4k7  R0402-B  [0402-B]
R104  200k  R0402-B  [0402-B]
R105  4k7  R0402-B  [0402-B]
R106  4k7  R0402-B  [0402-B]
R107  4k7  R0402-B  [0402-B]
R108  4k7  R0402-B  [0402-B]
R109  10k  R0402-B  [0402-B]
R119  200k  R0402-B  [0402-B]
R120  4k7  R0402-B  [0402-B]
R121  4k7  R0402-B  [0402-B]
R122  50k  R0402-B  [0402-B]  (not fitted in variant Min)
R123  50k  R0402-B  [0402-B]  (not fitted in variant Min)
R124  50k  R0402-B  [0402-B]  (not fitted in variant Min)
R125  50k  R0402-B  [0402-B]  (not fitted in variant Min)
SD1  MICRO-SD-2CD  [TF-MICRO-SD_PP2]
U4  PCA9306GM  [PCA9570GMH]
U5  PCA9306GM  [PCA9570GMH]
U25  PCA9306GM  [PCA9570GMH]
U27  TS3A4751  TS3A4751-BLOCK  [SOP65P640X120-14N]
U28  IP4251CZ16-8-TTL  [SON40P135X330X55-17N]
U30  PCA9306GM  [PCA9570GMH]
X1  PICO-SPOX-5  [PICO-SPOX-5]

### Nets
A_!RST: PB-NW.1 ; also sheet 7
A_BUS_EN [LVDS]: U27.12(EN4) U27.13(EN1) ; also sheet 7
A_SCL: PB-NW.2 R101.2 U4.5(D2)
A_SCL': R98.2 U4.4(S2) U27.11(NO4)
A_SDA: PB-NW.4 R100.2 U4.6(D1)
A_SDA': R97.2 U4.3(S1) U27.1(NO1)
AB_SCL: R93.2 U25.4(S2) ; also sheet 1
AB_SCL': R96.2 U25.5(D2) U27.9(COM3) U27.10(COM4) U30.5(D2)
AB_SDA: R92.2 U25.3(S1) ; also sheet 1
AB_SDA': R95.2 U25.6(D1) U27.2(COM1) U27.4(COM2) U30.6(D1)
B_!RST: PB-SE.1 ; also sheet 7
B_BUS_EN [power]: U27.5(EN2) U27.6(EN3) ; also sheet 7
B_SCL: PB-SE.2 R106.2 U5.5(D2)
B_SCL': R103.2 U5.4(S2) U27.8(NO3)
B_SDA: PB-SE.4 R105.2 U5.6(D1)
B_SDA': R102.2 U5.3(S1) U27.3(NO2)
BETA_5V [power]: X1.4 X1.4A ; also sheet 3,10
CD: SD1.CD1 SD1.CD2 U28.1(CH1)
CD': R109.2 U28.16(CH1_2) ; also sheet 7
CLK: SD1.5 U28.6(CH6)
CMD: R122.2 SD1.3 U28.5(CH5)
CTRL: X1.3 X1.3A
DAT0: R123.2 SD1.7 U28.7(CH7)
DAT1: R124.2 SD1.8 U28.8(CH8)
DAT2: R125.2 SD1.1 U28.3(CH3)
DAT3: SD1.2 U28.4(CH4)
E_VE_CV: PB-SE.20
E_VE_OV: PB-SE.9
E_VE_UV: PB-SE.11
GND: C11.2 C12.2 C82.2 C90.2 C91.2 C92.2 PB-NW.6 PB-SE.6 SD1.6 SD1.MT1(MT) SD1.MT2(MT) U4.1(GND) U5.1(GND) U25.1(GND) U27.7(GND) U28.17(EP) U30.1(GND) X1.1 X1.1A X1.5 X1.5A ; also sheet 1,2,3,6,7,8,9,10
IOE_V [power]: R104.1 R105.1 R106.1 ; also sheet 6,7
IOW_V [power]: R99.1 R100.1 R101.1 ; also sheet 6,7
N$3 [power]: C91.1 C92.1 FB1.2 R122.1 R123.1 R124.1 R125.1 SD1.4
N$7: C90.1 R119.2 U30.7(DREF) U30.8(GREF)
N$32: C11.1 R99.2 U4.7(DREF) U4.8(GREF)
N$33: C12.1 R104.2 U5.7(DREF) U5.8(GREF)
N$1006: C82.1 R94.2 U25.7(DREF) U25.8(GREF)
N_CHK_V: PB-NW.13
N_VE_CV: PB-NW.18
N_VE_OV: PB-NW.7
N_VE_RS: PB-NW.8
N_VE_UV: PB-NW.19
N_VN_CV: PB-NW.16
N_VN_OV: PB-NW.5
N_VN_RS: PB-NW.12
N_VN_UV: PB-NW.17
N_VW_CV: PB-NW.14
N_VW_OV: PB-NW.3
N_VW_RS: PB-NW.10
N_VW_UV: PB-NW.15
PMOD_D0: U28.9(CH8_2) ZED.101(_PMOD:PMOD_D0)
PMOD_D1: U28.10(CH7_2) ZED.102(_PMOD:PMOD_D1)
PMOD_D2: U28.12(CH5_2) ZED.103(_PMOD:PMOD_D2)
PMOD_D3: U28.11(CH6_2) ZED.104(_PMOD:PMOD_D3)
PMOD_D6: U28.14(CH3_2) ZED.107(_PMOD:PMOD_D6)
PMOD_D7: U28.13(CH4_2) ZED.108(_PMOD:PMOD_D7)
PMOD_SCL: R107.2 ZED.105(_PMOD:PMOD_D4) ; also sheet 6,7,8,9,10
PMOD_SDA: R108.2 ZED.106(_PMOD:PMOD_D5) ; also sheet 6,7,8,9,10
S_CHK_V: PB-SE.13
S_VE_CV: PB-SE.14
S_VE_OV: PB-SE.3
S_VE_RS: PB-SE.10
S_VE_UV: PB-SE.15
S_VS_CV: PB-SE.16
S_VS_OV: PB-SE.5
S_VS_RS: PB-SE.12
S_VS_UV: PB-SE.17
S_VW_CV: PB-SE.18
S_VW_OV: PB-SE.7
S_VW_RS: PB-SE.8
S_VW_UV: PB-SE.19
VCC [power]: FB1.1 R94.1 R95.1 R96.1 R97.1 R98.1 R102.1 R103.1 R107.1 R108.1 R109.1 R119.1 U4.2(SREF) U5.2(SREF) U27.14(VCC) ; also sheet 3,6,7,8,9,10
VCCIO [power]: R92.1 R93.1 U25.2(SREF) ; also sheet 9,10
VSB: R120.1 R121.1 U30.2(SREF) ; also sheet 3
W_VW_CV: PB-NW.20
W_VW_OV: PB-NW.9
W_VW_UV: PB-NW.11
X_SCL: R120.2 U30.4(S2) ; also sheet 3
X_SDA: R121.2 U30.3(S1) ; also sheet 3
ZED_5V [power]: X1.2 X1.2A ; also sheet 3,10
Unconnected: U28.2(CH2) U28.15(CH2_2)

### Buses
PMOD_D[0..7]
CMD,CLK,DAT[0..3],CD

### Notes on the sheet
- WUERTH 693071010811
  
  
  Alternatives (new LP):
  MOLEX 4735-21001
  MEM2051-00-195-00-A
- AXIOM Beta Power Board
- Level Translation and µSD
- Copyright (C) 2014-2020 H.Poetzl
  Licensed under CERN OHL v.1.2

## Sheet 6 of 10
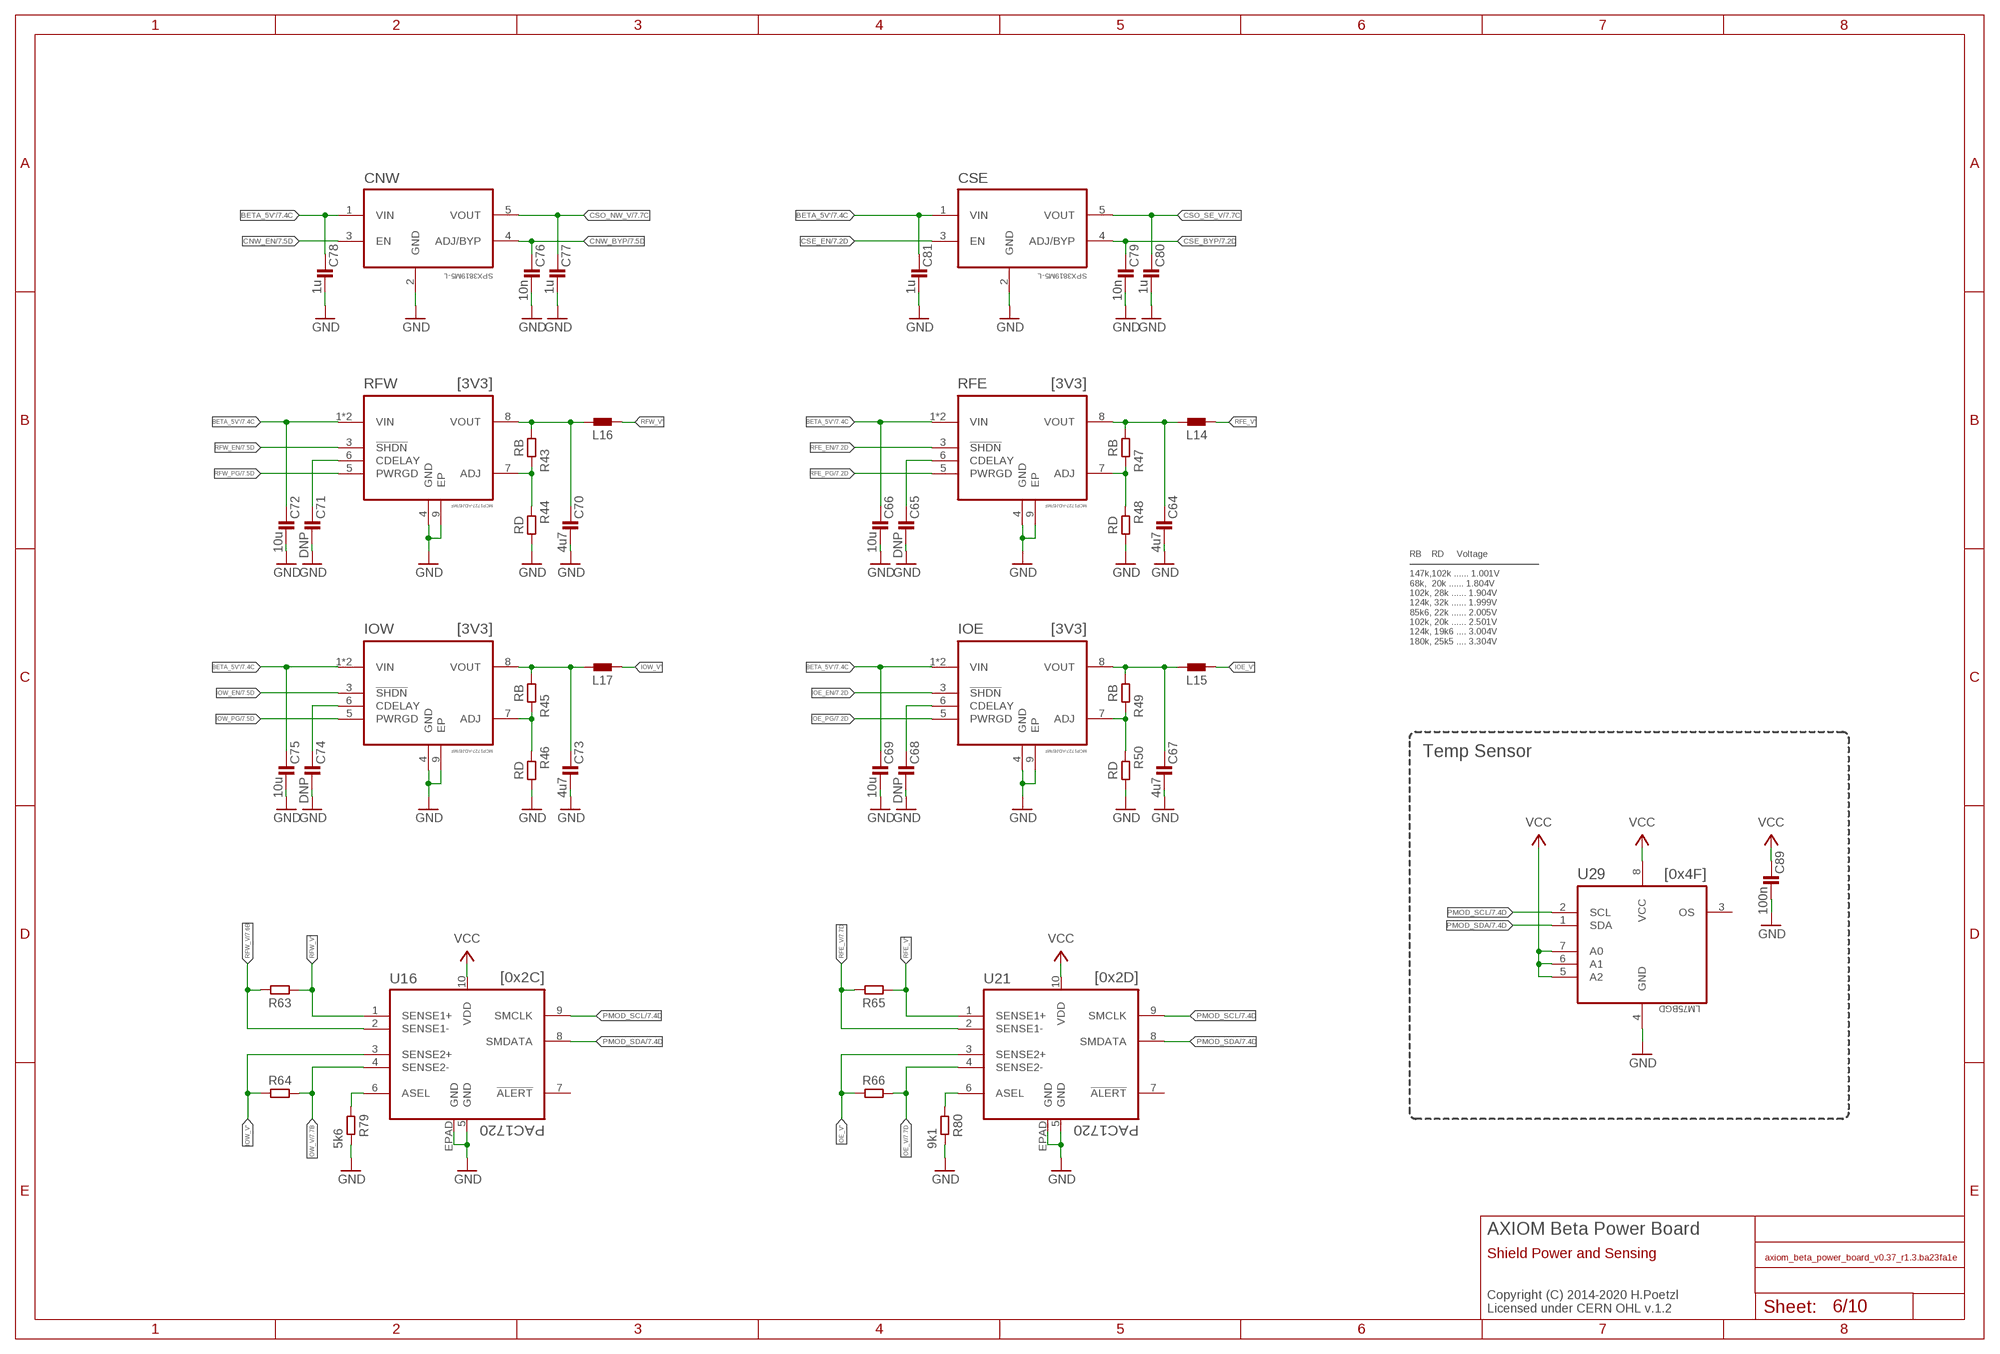
[diagram p5: schematic, sheet 6]

### Parts
C64  4u7  C0603-B  [0603-B]
C65  DNP  C0402-B  [0402-B]  (not fitted in variant Min)  (not fitted in variant Tele)
C66  10u  C0603-B  [0603-B]
C67  4u7  C0603-B  [0603-B]
C68  DNP  C0402-B  [0402-B]  (not fitted in variant Min)  (not fitted in variant Tele)
C69  10u  C0603-B  [0603-B]
C70  4u7  C0603-B  [0603-B]
C71  DNP  C0402-B  [0402-B]  (not fitted in variant Min)  (not fitted in variant Tele)
C72  10u  C0603-B  [0603-B]
C73  4u7  C0603-B  [0603-B]
C74  DNP  C0402-B  [0402-B]  (not fitted in variant Min)  (not fitted in variant Tele)
C75  10u  C0603-B  [0603-B]
C76  10n  C0402-B  [0402-B]
C77  1u  C0402-B  [0402-B]
C78  1u  C0402-B  [0402-B]
C79  10n  C0402-B  [0402-B]
C80  1u  C0402-B  [0402-B]
C81  1u  C0402-B  [0402-B]
C89  100n  C0402-B  [0402-B]
CNW  SPX3819M5-L  [SOT95P280X145-5N]
CSE  SPX3819M5-L  [SOT95P280X145-5N]
IOE  MCP1727-ADJE/MF  [DFN65P300X300X100-9N]
IOW  MCP1727-ADJE/MF  [DFN65P300X300X100-9N]
L14  L0805-B  [0805-B]
L15  L0805-B  [0805-B]
L16  L0805-B  [0805-B]
L17  L0805-B  [0805-B]
R43  RB  R0402-B  [0402-B]  (variant Tele: 180k)
R44  RD  R0402-B  [0402-B]  (variant Tele: 25k5)
R45  RB  R0402-B  [0402-B]  (variant Tele: 180k)
R46  RD  R0402-B  [0402-B]  (variant Tele: 25k5)
R47  RB  R0402-B  [0402-B]  (variant Tele: 180k)
R48  RD  R0402-B  [0402-B]  (variant Tele: 25k5)
R49  RB  R0402-B  [0402-B]  (variant Tele: 180k)
R50  RD  R0402-B  [0402-B]  (variant Tele: 25k5)
R63  R1206-B  [1206-B]
R64  R1206-B  [1206-B]
R65  R1206-B  [1206-B]
R66  R1206-B  [1206-B]
R79  5k6  R0402-B  [0402-B]
R80  9k1  R0402-B  [0402-B]
RFE  MCP1727-ADJE/MF  [DFN65P300X300X100-9N]
RFW  MCP1727-ADJE/MF  [DFN65P300X300X100-9N]
U16  PAC1720  [DFN3X3_10LEAD]
U21  PAC1720  [DFN3X3_10LEAD]
U29  LM75BGD  [SOT996-2/3]

### Nets
BETA_5V' [power]: C66.1 C69.1 C72.1 C75.1 C78.1 C81.1 CNW.1(VIN) CSE.1(VIN) IOE.1(VIN) IOE.2(VIN) IOW.1(VIN) IOW.2(VIN) RFE.1(VIN) RFE.2(VIN) RFW.1(VIN) RFW.2(VIN) ; also sheet 3,7,8,10
CNW_BYP: C76.1 CNW.4(ADJ/BYP) ; also sheet 7
CNW_EN: CNW.3(EN) ; also sheet 7
CSE_BYP: C79.1 CSE.4(ADJ/BYP) ; also sheet 7
CSE_EN: CSE.3(EN) ; also sheet 7
CSO_NW_V [power]: C77.1 CNW.5(VOUT) ; also sheet 7
CSO_SE_V [power]: C80.1 CSE.5(VOUT) ; also sheet 7
GND: C64.2 C65.2 C66.2 C67.2 C68.2 C69.2 C70.2 C71.2 C72.2 C73.2 C74.2 C75.2 C76.2 C77.2 C78.2 C79.2 C80.2 C81.2 C89.2 CNW.2(GND) CSE.2(GND) IOE.4(GND) IOE.9(EP) IOW.4(GND) IOW.9(EP) R44.2 R46.2 R48.2 R50.2 R79.2 R80.2 RFE.4(GND) RFE.9(EP) RFW.4(GND) RFW.9(EP) U16.5(GND) U16.EPAD(GND) U21.5(GND) U21.EPAD(GND) U29.4(GND) ; also sheet 1,2,3,5,7,8,9,10
IOE_EN: IOE.3(!SHDN) ; also sheet 7
IOE_PG: IOE.5(PWRGD) ; also sheet 7
IOE_V [power]: R66.2 U21.4(SENSE2-) ; also sheet 5,7
IOE_V': L15.2 R66.1 U21.3(SENSE2+)
IOW_EN: IOW.3(!SHDN) ; also sheet 7
IOW_PG: IOW.5(PWRGD) ; also sheet 7
IOW_V [power]: R64.2 U16.4(SENSE2-) ; also sheet 5,7
IOW_V': L17.2 R64.1 U16.3(SENSE2+)
N$48: C64.1 L14.1 R47.1 RFE.8(VOUT)
N$49: R47.2 R48.1 RFE.7(ADJ)
N$97: C65.1 RFE.6(CDELAY)
N$98: C67.1 IOE.8(VOUT) L15.1 R49.1
N$420: IOE.7(ADJ) R49.2 R50.1
N$421: C68.1 IOE.6(CDELAY)
N$612: C70.1 L16.1 R43.1 RFW.8(VOUT)
N$613: R43.2 R44.1 RFW.7(ADJ)
N$804: C71.1 RFW.6(CDELAY)
N$805: C73.1 IOW.8(VOUT) L17.1 R45.1
N$996: IOW.7(ADJ) R45.2 R46.1
N$997: C74.1 IOW.6(CDELAY)
N$999: R79.1 U16.6(ASEL)
N$1015: R80.1 U21.6(ASEL)
PMOD_SCL: U16.9(SMCLK) U21.9(SMCLK) U29.2(SCL) ; also sheet 5,7,8,9,10
PMOD_SDA: U16.8(SMDATA) U21.8(SMDATA) U29.1(SDA) ; also sheet 5,7,8,9,10
RFE_EN: RFE.3(!SHDN) ; also sheet 7
RFE_PG: RFE.5(PWRGD) ; also sheet 7
RFE_V [power]: R65.2 U21.2(SENSE1-) ; also sheet 7
RFE_V': L14.2 R65.1 U21.1(SENSE1+)
RFW_EN: RFW.3(!SHDN) ; also sheet 7
RFW_PG: RFW.5(PWRGD) ; also sheet 7
RFW_V [power]: R63.2 U16.2(SENSE1-) ; also sheet 7
RFW_V': L16.2 R63.1 U16.1(SENSE1+)
VCC [power]: C89.1 U16.10(VDD) U21.10(VDD) U29.5(A2) U29.6(A1) U29.7(A0) U29.8(VCC) ; also sheet 3,5,7,8,9,10
Unconnected: U16.7(!ALERT) U21.7(!ALERT) U29.3(OS)

### Notes on the sheet
- [3V3] | [3V3]
- RB    RD     Voltage
  
  147k,102k ...... 1.001V
  68k,  20k ...... 1.804V
  102k, 28k ...... 1.904V
  124k, 32k ...... 1.999V
  85k6, 22k ...... 2.005V
  102k, 20k ...... 2.501V
  124k, 19k6 .... 3.004V
  180k, 25k5 .... 3.304V
- [3V3] | [3V3]
- Temp Sensor
- [0x4F]
- [0x2C] | [0x2D]
- AXIOM Beta Power Board
- Shield Power and Sensing
- Copyright (C) 2014-2020 H.Poetzl
  Licensed under CERN OHL v.1.2

## Sheet 7 of 10
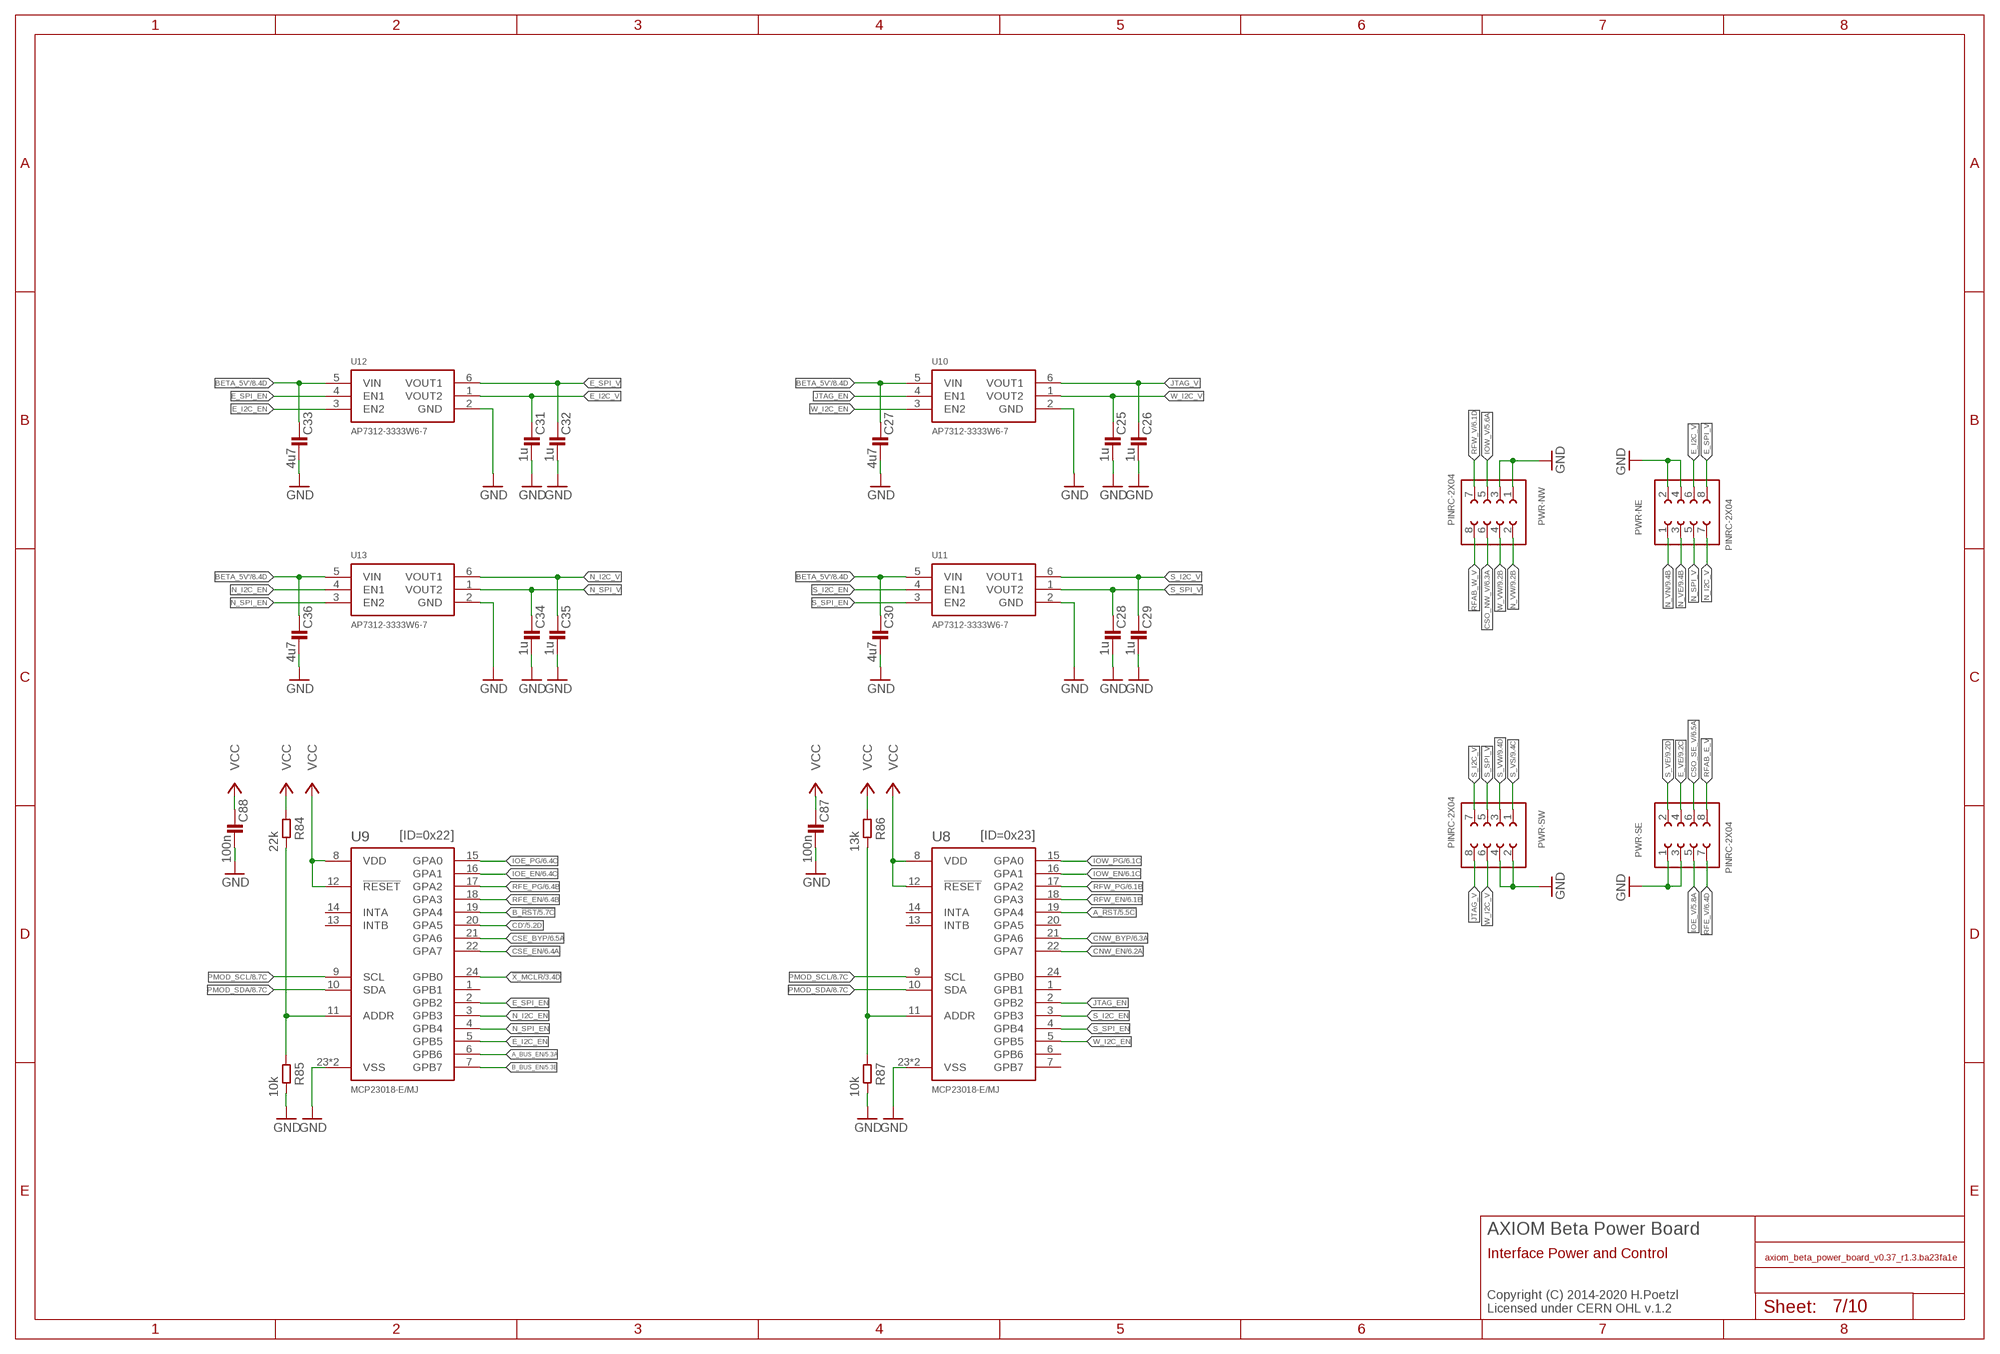
[diagram p6: schematic, sheet 7]

### Parts
C25  1u  C0402-B  [0402-B]
C26  1u  C0402-B  [0402-B]
C27  4u7  C0603-B  [0603-B]
C28  1u  C0402-B  [0402-B]
C29  1u  C0402-B  [0402-B]
C30  4u7  C0603-B  [0603-B]
C31  1u  C0402-B  [0402-B]
C32  1u  C0402-B  [0402-B]
C33  4u7  C0603-B  [0603-B]
C34  1u  C0402-B  [0402-B]
C35  1u  C0402-B  [0402-B]
C36  4u7  C0603-B  [0603-B]
C87  100n  C0402-B  [0402-B]
C88  100n  C0402-B  [0402-B]
PWR-NE  PINRC-2X04  [R2X04]  (not fitted in variant Beta)  (not fitted in variant Min)
PWR-NW  PINRC-2X04  [R2X04]  (not fitted in variant Beta)  (not fitted in variant Min)
PWR-SE  PINRC-2X04  [R2X04]  (not fitted in variant Beta)  (not fitted in variant Min)
PWR-SW  PINRC-2X04  [R2X04]  (not fitted in variant Beta)  (not fitted in variant Min)
R84  22k  R0402-B  [0402-B]
R85  10k  R0402-B  [0402-B]
R86  13k  R0402-B  [0402-B]
R87  10k  R0402-B  [0402-B]
U8  MCP23018-E/MJ  MCP23018QFN  [QFN50P400X400X80-25N]
U9  MCP23018-E/MJ  MCP23018QFN  [QFN50P400X400X80-25N]
U10  AP7312-3333W6-7  LDO_DUAL-AP7312  [SOT23-6]
U11  AP7312-3333W6-7  LDO_DUAL-AP7312  [SOT23-6]
U12  AP7312-3333W6-7  LDO_DUAL-AP7312  [SOT23-6]
U13  AP7312-3333W6-7  LDO_DUAL-AP7312  [SOT23-6]

### Nets
!X_MCLR: U9.24(GPB0) ; also sheet 3
A_!RST: U8.19(GPA4) ; also sheet 5
A_BUS_EN [LVDS]: U9.6(GPB6) ; also sheet 5
B_!RST: U9.19(GPA4) ; also sheet 5
B_BUS_EN [power]: U9.7(GPB7) ; also sheet 5
BETA_5V' [power]: C27.1 C30.1 C33.1 C36.1 U10.5(VIN) U11.5(VIN) U12.5(VIN) U13.5(VIN) ; also sheet 3,6,8,10
CD': U9.20(GPA5) ; also sheet 5
CNW_BYP: U8.21(GPA6) ; also sheet 6
CNW_EN: U8.22(GPA7) ; also sheet 6
CSE_BYP: U9.21(GPA6) ; also sheet 6
CSE_EN: U9.22(GPA7) ; also sheet 6
CSO_NW_V [power]: PWR-NW.6 ; also sheet 6
CSO_SE_V [power]: PWR-SE.6 ; also sheet 6
E_I2C_EN: U9.5(GPB5) U12.3(EN2)
E_I2C_V [power]: C31.1 PWR-NE.6 U12.1(VOUT2)
E_SPI_EN: U9.2(GPB2) U12.4(EN1)
E_SPI_V [power]: C32.1 PWR-NE.8 U12.6(VOUT1)
E_VE [power]: PWR-SE.4 ; also sheet 9
GND: C25.2 C26.2 C27.2 C28.2 C29.2 C30.2 C31.2 C32.2 C33.2 C34.2 C35.2 C36.2 C87.2 C88.2 PWR-NE.2 PWR-NE.4 PWR-NW.1 PWR-NW.3 PWR-SE.1 PWR-SE.3 PWR-SW.2 PWR-SW.4 R85.2 R87.2 U8.23(VSS) U8.25(VSS) U9.23(VSS) U9.25(VSS) U10.2(GND) U11.2(GND) U12.2(GND) U13.2(GND) ; also sheet 1,2,3,5,6,8,9,10
IOE_EN: U9.16(GPA1) ; also sheet 6
IOE_PG: U9.15(GPA0) ; also sheet 6
IOE_V [power]: PWR-SE.5 ; also sheet 5,6
IOW_EN: U8.16(GPA1) ; also sheet 6
IOW_PG: U8.15(GPA0) ; also sheet 6
IOW_V [power]: PWR-NW.5 ; also sheet 5,6
JTAG_EN: U8.2(GPB2) U10.4(EN1)
JTAG_V [power]: C26.1 PWR-SW.8 U10.6(VOUT1)
N$244: R84.2 R85.1 U9.11(ADDR)
N$250: R86.2 R87.1 U8.11(ADDR)
N_I2C_EN: U9.3(GPB3) U13.4(EN1)
N_I2C_V [power]: C35.1 PWR-NE.7 U13.6(VOUT1)
N_SPI_EN: U9.4(GPB4) U13.3(EN2)
N_SPI_V [power]: C34.1 PWR-NE.5 U13.1(VOUT2)
N_VE [power]: PWR-NE.3 ; also sheet 9
N_VN [power]: PWR-NE.1 ; also sheet 9
N_VW [power]: PWR-NW.2 ; also sheet 9
PMOD_SCL: U8.9(SCL) U9.9(SCL) ; also sheet 5,6,8,9,10
PMOD_SDA: U8.10(SDA) U9.10(SDA) ; also sheet 5,6,8,9,10
RFAB_E_V [power]: PWR-SE.8
RFAB_W_V [power]: PWR-NW.8
RFE_EN: U9.18(GPA3) ; also sheet 6
RFE_PG: U9.17(GPA2) ; also sheet 6
RFE_V [power]: PWR-SE.7 ; also sheet 6
RFW_EN: U8.18(GPA3) ; also sheet 6
RFW_PG: U8.17(GPA2) ; also sheet 6
RFW_V [power]: PWR-NW.7 ; also sheet 6
S_I2C_EN: U8.3(GPB3) U11.4(EN1)
S_I2C_V [power]: C29.1 PWR-SW.7 U11.6(VOUT1)
S_SPI_EN: U8.4(GPB4) U11.3(EN2)
S_SPI_V [power]: C28.1 PWR-SW.5 U11.1(VOUT2)
S_VE [power]: PWR-SE.2 ; also sheet 9
S_VS [power]: PWR-SW.1 ; also sheet 9
S_VW [power]: PWR-SW.3 ; also sheet 9
VCC [power]: C87.1 C88.1 R84.1 R86.1 U8.8(VDD) U8.12(!RESET) U9.8(VDD) U9.12(!RESET) ; also sheet 3,5,6,8,9,10
W_I2C_EN: U8.5(GPB5) U10.3(EN2)
W_I2C_V [power]: C25.1 PWR-SW.6 U10.1(VOUT2)
W_VW [power]: PWR-NW.4 ; also sheet 9
Unconnected: U8.1(GPB1) U8.6(GPB6) U8.7(GPB7) U8.13(INTB) U8.14(INTA) U8.20(GPA5) U8.24(GPB0) U9.1(GPB1) U9.13(INTB) U9.14(INTA)

### Notes on the sheet
- [ID=0x22] | [ID=0x23]
- AXIOM Beta Power Board
- Interface Power and Control
- Copyright (C) 2014-2020 H.Poetzl
  Licensed under CERN OHL v.1.2

## Sheet 8 of 10
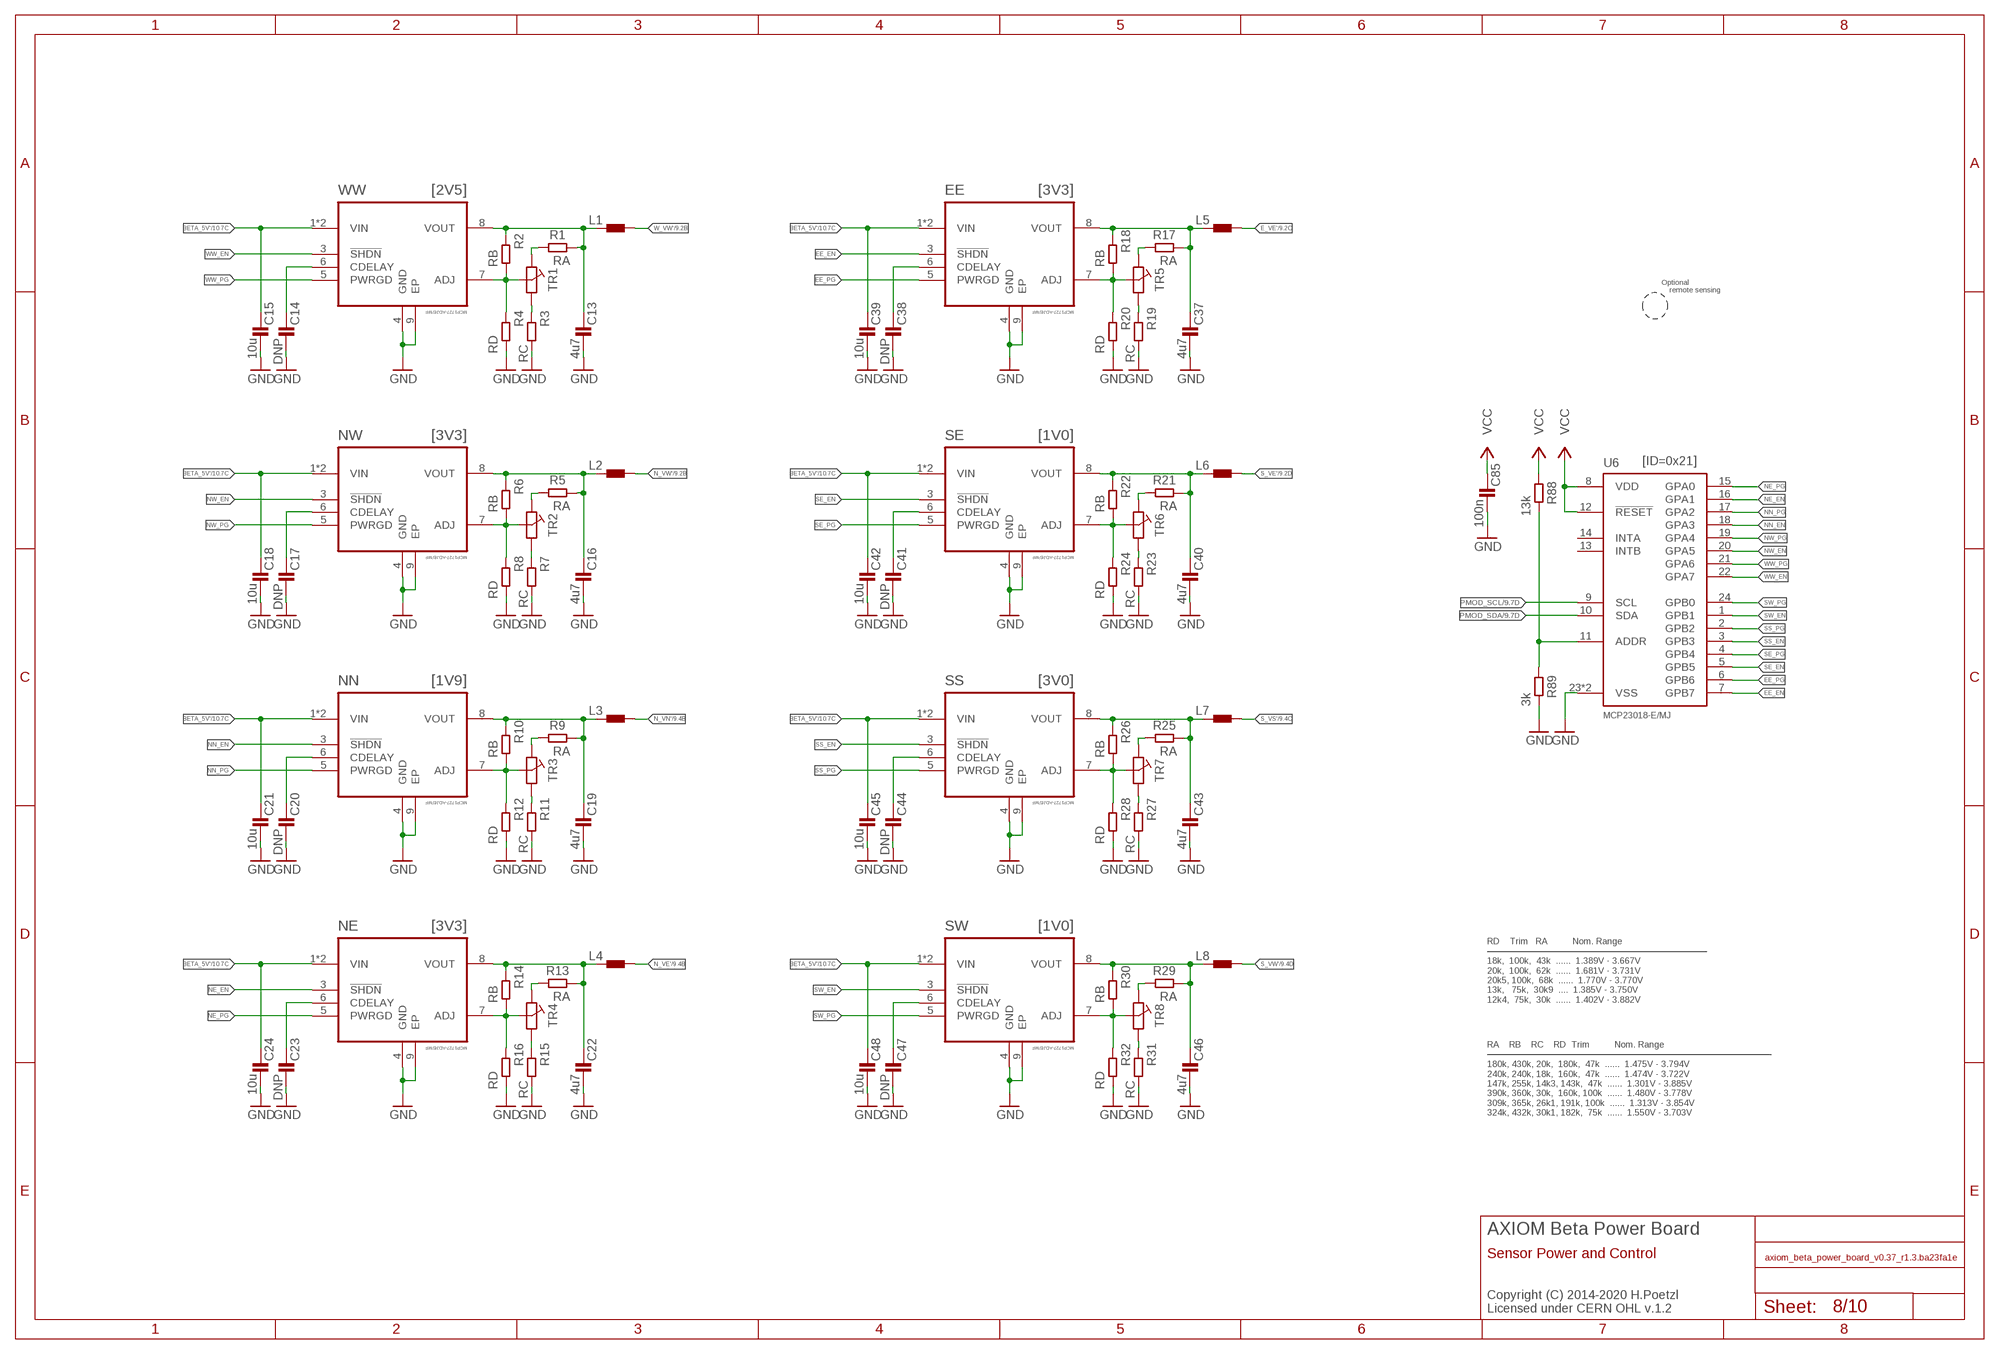
[diagram p7: schematic, sheet 8]

### Parts
C13  4u7  C0603-B  [0603-B]
C14  DNP  C0402-B  [0402-B]  (not fitted in variant Min)  (not fitted in variant Tele)
C15  10u  C0603-B  [0603-B]
C16  4u7  C0603-B  [0603-B]
C17  DNP  C0402-B  [0402-B]  (not fitted in variant Min)  (not fitted in variant Tele)
C18  10u  C0603-B  [0603-B]
C19  4u7  C0603-B  [0603-B]
C20  DNP  C0402-B  [0402-B]  (not fitted in variant Min)  (not fitted in variant Tele)
C21  10u  C0603-B  [0603-B]
C22  4u7  C0603-B  [0603-B]
C23  DNP  C0402-B  [0402-B]  (not fitted in variant Min)  (not fitted in variant Tele)
C24  10u  C0603-B  [0603-B]
C37  4u7  C0603-B  [0603-B]
C38  DNP  C0402-B  [0402-B]  (not fitted in variant Min)  (not fitted in variant Tele)
C39  10u  C0603-B  [0603-B]
C40  4u7  C0603-B  [0603-B]
C41  DNP  C0402-B  [0402-B]  (not fitted in variant Min)  (not fitted in variant Tele)
C42  10u  C0603-B  [0603-B]
C43  4u7  C0603-B  [0603-B]
C44  DNP  C0402-B  [0402-B]  (not fitted in variant Min)  (not fitted in variant Tele)
C45  10u  C0603-B  [0603-B]
C46  4u7  C0603-B  [0603-B]
C47  DNP  C0402-B  [0402-B]  (not fitted in variant Min)  (not fitted in variant Tele)
C48  10u  C0603-B  [0603-B]
C85  100n  C0402-B  [0402-B]
EE  MCP1727-ADJE/MF  [DFN65P300X300X100-9N]
L1  L0805-B  [0805-B]
L2  L0805-B  [0805-B]
L3  L0805-B  [0805-B]
L4  L0805-B  [0805-B]
L5  L0805-B  [0805-B]
L6  L0805-B  [0805-B]
L7  L0805-B  [0805-B]
L8  L0805-B  [0805-B]
NE  MCP1727-ADJE/MF  [DFN65P300X300X100-9N]
NN  MCP1727-ADJE/MF  [DFN65P300X300X100-9N]
NW  MCP1727-ADJE/MF  [DFN65P300X300X100-9N]
R1  RA  R0402-B  [0402-B]  (not fitted in variant Tele)
R2  RB  R0402-B  [0402-B]  (not fitted in variant Min)  (variant Tele: 102k)
R3  RC  R0402-B  [0402-B]  (not fitted in variant Min)  (not fitted in variant Tele)
R4  RD  R0402-B  [0402-B]  (variant Tele: 20k)
R5  RA  R0402-B  [0402-B]  (not fitted in variant Tele)
R6  RB  R0402-B  [0402-B]  (not fitted in variant Min)  (variant Tele: 180k)
R7  RC  R0402-B  [0402-B]  (not fitted in variant Min)  (not fitted in variant Tele)
R8  RD  R0402-B  [0402-B]  (variant Tele: 25k5)
R9  RA  R0402-B  [0402-B]  (not fitted in variant Tele)
R10  RB  R0402-B  [0402-B]  (not fitted in variant Min)  (variant Tele: 102k)
R11  RC  R0402-B  [0402-B]  (not fitted in variant Min)  (not fitted in variant Tele)
R12  RD  R0402-B  [0402-B]  (variant Tele: 28k)
R13  RA  R0402-B  [0402-B]  (not fitted in variant Tele)
R14  RB  R0402-B  [0402-B]  (not fitted in variant Min)  (variant Tele: 180k)
R15  RC  R0402-B  [0402-B]  (not fitted in variant Min)  (not fitted in variant Tele)
R16  RD  R0402-B  [0402-B]  (variant Tele: 25k5)
R17  RA  R0402-B  [0402-B]  (not fitted in variant Tele)
R18  RB  R0402-B  [0402-B]  (not fitted in variant Min)  (variant Tele: 180k)
R19  RC  R0402-B  [0402-B]  (not fitted in variant Min)  (not fitted in variant Tele)
R20  RD  R0402-B  [0402-B]  (variant Tele: 25k5)
R21  RA  R0402-B  [0402-B]  (not fitted in variant Tele)
R22  RB  R0402-B  [0402-B]  (not fitted in variant Min)  (variant Tele: 147k)
R23  RC  R0402-B  [0402-B]  (not fitted in variant Min)  (not fitted in variant Tele)
R24  RD  R0402-B  [0402-B]  (variant Tele: 102k)
R25  RA  R0402-B  [0402-B]  (not fitted in variant Tele)
R26  RB  R0402-B  [0402-B]  (not fitted in variant Min)  (variant Tele: 124k)
R27  RC  R0402-B  [0402-B]  (not fitted in variant Min)  (not fitted in variant Tele)
R28  RD  R0402-B  [0402-B]  (variant Tele: 19k6)
R29  RA  R0402-B  [0402-B]  (not fitted in variant Tele)
R30  RB  R0402-B  [0402-B]  (not fitted in variant Min)  (variant Tele: 147k)
R31  RC  R0402-B  [0402-B]  (not fitted in variant Min)  (not fitted in variant Tele)
R32  RD  R0402-B  [0402-B]  (variant Tele: 102k)
R88  13k  R0402-B  [0402-B]
R89  3k  R0402-B  [0402-B]
SE  MCP1727-ADJE/MF  [DFN65P300X300X100-9N]
SS  MCP1727-ADJE/MF  [DFN65P300X300X100-9N]
SW  MCP1727-ADJE/MF  [DFN65P300X300X100-9N]
TR1  PVZ2A  [TRIM-PVZ2A]  (not fitted in variant Tele)
TR2  PVZ2A  [TRIM-PVZ2A]  (not fitted in variant Tele)
TR3  PVZ2A  [TRIM-PVZ2A]  (not fitted in variant Tele)
TR4  PVZ2A  [TRIM-PVZ2A]  (not fitted in variant Tele)
TR5  PVZ2A  [TRIM-PVZ2A]  (not fitted in variant Tele)
TR6  PVZ2A  [TRIM-PVZ2A]  (not fitted in variant Tele)
TR7  PVZ2A  [TRIM-PVZ2A]  (not fitted in variant Tele)
TR8  PVZ2A  [TRIM-PVZ2A]  (not fitted in variant Tele)
U6  MCP23018-E/MJ  MCP23018QFN  [QFN50P400X400X80-25N]
WW  MCP1727-ADJE/MF  [DFN65P300X300X100-9N]

### Nets
BETA_5V' [power]: C15.1 C18.1 C21.1 C24.1 C39.1 C42.1 C45.1 C48.1 EE.1(VIN) EE.2(VIN) NE.1(VIN) NE.2(VIN) NN.1(VIN) NN.2(VIN) NW.1(VIN) NW.2(VIN) SE.1(VIN) SE.2(VIN) SS.1(VIN) SS.2(VIN) SW.1(VIN) SW.2(VIN) WW.1(VIN) WW.2(VIN) ; also sheet 3,6,7,10
E_VE': L5.2 ; also sheet 9
EE_EN: EE.3(!SHDN) U6.7(GPB7)
EE_PG: EE.5(PWRGD) U6.6(GPB6)
GND: C13.2 C14.2 C15.2 C16.2 C17.2 C18.2 C19.2 C20.2 C21.2 C22.2 C23.2 C24.2 C37.2 C38.2 C39.2 C40.2 C41.2 C42.2 C43.2 C44.2 C45.2 C46.2 C47.2 C48.2 C85.2 EE.4(GND) EE.9(EP) NE.4(GND) NE.9(EP) NN.4(GND) NN.9(EP) NW.4(GND) NW.9(EP) R3.2 R4.2 R7.2 R8.2 R11.2 R12.2 R15.2 R16.2 R19.2 R20.2 R23.2 R24.2 R27.2 R28.2 R31.2 R32.2 R89.2 SE.4(GND) SE.9(EP) SS.4(GND) SS.9(EP) SW.4(GND) SW.9(EP) U6.23(VSS) U6.25(VSS) WW.4(GND) WW.9(EP) ; also sheet 1,2,3,5,6,7,9,10
N$34 [power]: C13.1 L1.1 R1.2 R2.1 WW.8(VOUT)
N$39: R2.2 R4.1 TR1.2(B) WW.7(ADJ)
N$41: R3.1 TR1.1(A)
N$88: C14.1 WW.6(CDELAY)
N$253: R1.1 TR1.3(C)
N$416: C16.1 L2.1 NW.8(VOUT) R5.2 R6.1
N$417: NW.7(ADJ) R6.2 R8.1 TR2.2(B)
N$418: R7.1 TR2.1(A)
N$419: C17.1 NW.6(CDELAY)
N$608: C19.1 L3.1 NN.8(VOUT) R9.2 R10.1
N$609: NN.7(ADJ) R10.2 R12.1 TR3.2(B)
N$610: R5.1 TR2.3(C)
N$611: C20.1 NN.6(CDELAY)
N$800: C22.1 L4.1 NE.8(VOUT) R13.2 R14.1
N$801: NE.7(ADJ) R14.2 R16.1 TR4.2(B)
N$802: R11.1 TR3.1(A)
N$803: C23.1 NE.6(CDELAY)
N$992: C37.1 EE.8(VOUT) L5.1 R17.2 R18.1
N$993: EE.7(ADJ) R18.2 R20.1 TR5.2(B)
N$994: R9.1 TR3.3(C)
N$995: C38.1 EE.6(CDELAY)
N$998: R15.1 TR4.1(A)
N$1000: C40.1 L6.1 R21.2 R22.1 SE.8(VOUT)
N$1001: R22.2 R24.1 SE.7(ADJ) TR6.2(B)
N$1002: R13.1 TR4.3(C)
N$1003: C41.1 SE.6(CDELAY)
N$1007: R19.1 TR5.1(A)
N$1008: C43.1 L7.1 R25.2 R26.1 SS.8(VOUT)
N$1009: R26.2 R28.1 SS.7(ADJ) TR7.2(B)
N$1010: R17.1 TR5.3(C)
N$1011: C44.1 SS.6(CDELAY)
N$1014: R23.1 TR6.1(A)
N$1016: C46.1 L8.1 R29.2 R30.1 SW.8(VOUT)
N$1017: R30.2 R32.1 SW.7(ADJ) TR8.2(B)
N$1018: R21.1 TR6.3(C)
N$1019: C47.1 SW.6(CDELAY)
N$1022: R27.1 TR7.1(A)
N$1944: R25.1 TR7.3(C)
N$3239: R31.1 TR8.1(A)
N$3430: R29.1 TR8.3(C)
N$4020: R88.2 R89.1 U6.11(ADDR)
N_VE': L4.2 ; also sheet 9
N_VN': L3.2 ; also sheet 9
N_VW': L2.2 ; also sheet 9
NE_EN: NE.3(!SHDN) U6.16(GPA1)
NE_PG: NE.5(PWRGD) U6.15(GPA0)
NN_EN: NN.3(!SHDN) U6.18(GPA3)
NN_PG: NN.5(PWRGD) U6.17(GPA2)
NW_EN: NW.3(!SHDN) U6.20(GPA5)
NW_PG: NW.5(PWRGD) U6.19(GPA4)
PMOD_SCL: U6.9(SCL) ; also sheet 5,6,7,9,10
PMOD_SDA: U6.10(SDA) ; also sheet 5,6,7,9,10
S_VE': L6.2 ; also sheet 9
S_VS': L7.2 ; also sheet 9
S_VW': L8.2 ; also sheet 9
SE_EN: SE.3(!SHDN) U6.5(GPB5)
SE_PG: SE.5(PWRGD) U6.4(GPB4)
SS_EN: SS.3(!SHDN) U6.3(GPB3)
SS_PG: SS.5(PWRGD) U6.2(GPB2)
SW_EN: SW.3(!SHDN) U6.1(GPB1)
SW_PG: SW.5(PWRGD) U6.24(GPB0)
VCC [power]: C85.1 R88.1 U6.8(VDD) U6.12(!RESET) ; also sheet 3,5,6,7,9,10
W_VW' [power]: L1.2 ; also sheet 9
WW_EN: U6.22(GPA7) WW.3(!SHDN)
WW_PG: U6.21(GPA6) WW.5(PWRGD)
Unconnected: U6.13(INTB) U6.14(INTA)

### Notes on the sheet
- [2V5] | [3V3]
- Optional
      remote sensing
- [3V3] | [1V0]
- [ID=0x21]
- [1V9] | [3V0]
- [3V3] | [1V0]
- RD    Trim   RA          Nom. Range
  
  18k,  100k,  43k  ......  1.389V - 3.667V
  20k,  100k,  62k  ......  1.681V - 3.731V
  20k5, 100k,  68k  ......  1.770V - 3.770V
  13k,   75k,  30k9  ....  1.385V - 3.750V
  12k4,  75k,  30k  ......  1.402V - 3.882V
- RA    RB    RC    RD  Trim          Nom. Range
  
  180k, 430k, 20k,  180k,  47k  ......  1.475V - 3.794V
  240k, 240k, 18k,  160k,  47k  ......  1.474V - 3.722V
  147k, 255k, 14k3, 143k,  47k  ......  1.301V - 3.885V
  390k, 360k, 30k,  160k, 100k  ......  1.480V - 3.778V
  309k, 365k, 26k1, 191k, 100k  ......  1.313V - 3.854V
  324k, 432k, 30k1, 182k,  75k  ......  1.550V - 3.703V
- AXIOM Beta Power Board
- Sensor Power and Control
- Copyright (C) 2014-2020 H.Poetzl
  Licensed under CERN OHL v.1.2

## Sheet 9 of 10
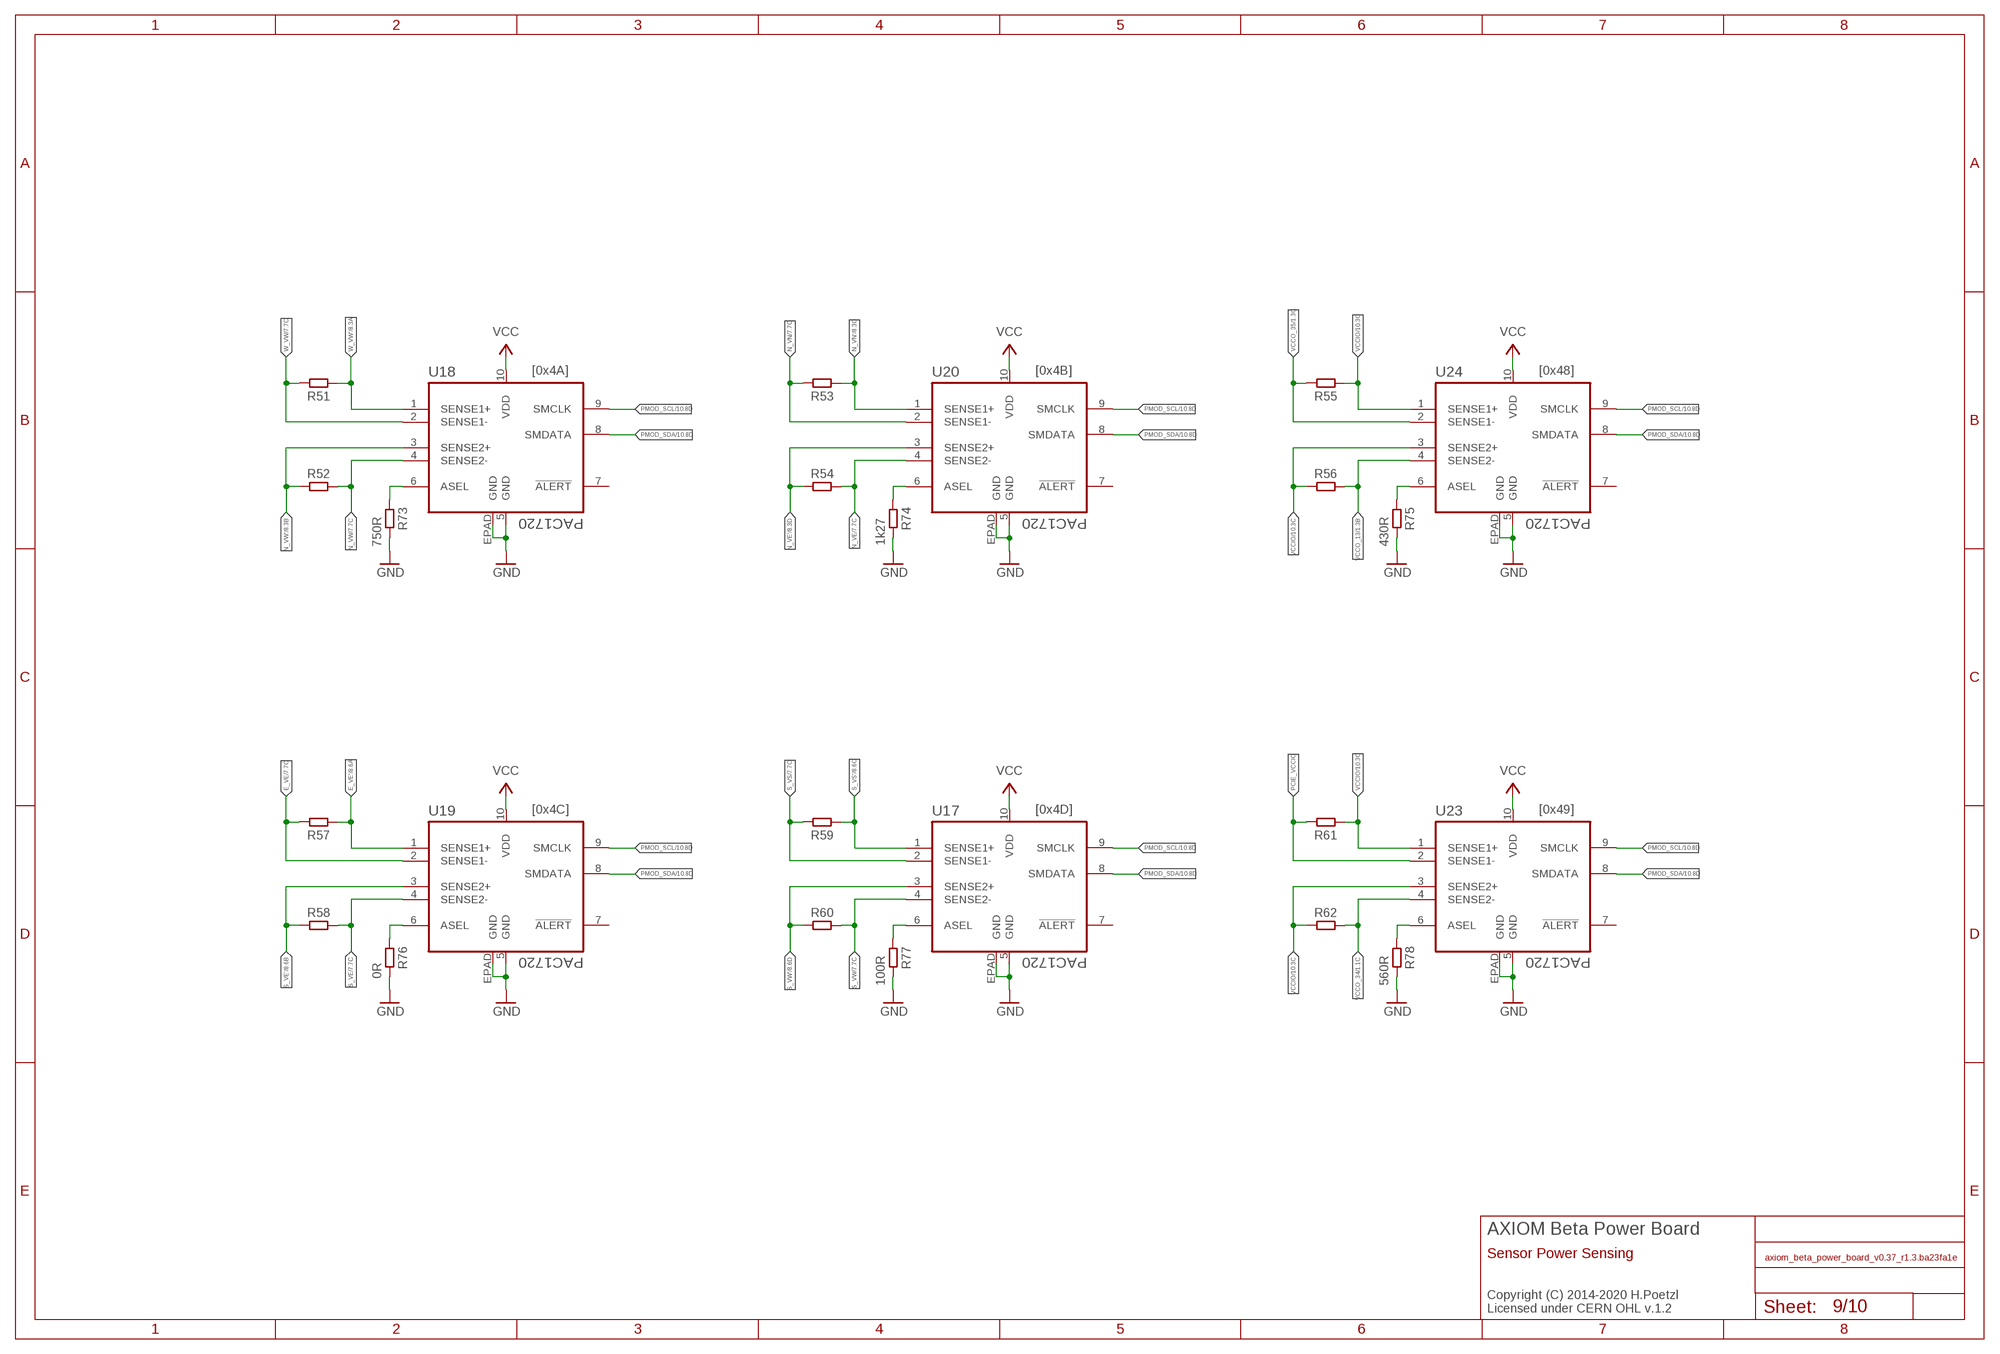
[diagram p8: schematic, sheet 9]

### Parts
R51  R1206-B  [1206-B]
R52  R1206-B  [1206-B]
R53  R1206-B  [1206-B]
R54  R1206-B  [1206-B]
R55  R1206-B  [1206-B]
R56  R1206-B  [1206-B]
R57  R1206-B  [1206-B]
R58  R1206-B  [1206-B]
R59  R1206-B  [1206-B]
R60  R1206-B  [1206-B]
R61  R1206-B  [1206-B]
R62  R1206-B  [1206-B]
R73  750R  R0402-B  [0402-B]
R74  1k27  R0402-B  [0402-B]
R75  430R  R0402-B  [0402-B]
R76  0R  R0402-B  [0402-B]
R77  100R  R0402-B  [0402-B]
R78  560R  R0402-B  [0402-B]
U17  PAC1720  [DFN3X3_10LEAD]
U18  PAC1720  [DFN3X3_10LEAD]
U19  PAC1720  [DFN3X3_10LEAD]
U20  PAC1720  [DFN3X3_10LEAD]
U23  PAC1720  [DFN3X3_10LEAD]
U24  PAC1720  [DFN3X3_10LEAD]

### Nets
E_VE [power]: R57.2 U19.2(SENSE1-) ; also sheet 7
E_VE': R57.1 U19.1(SENSE1+) ; also sheet 8
GND: R73.2 R74.2 R75.2 R76.2 R77.2 R78.2 U17.5(GND) U17.EPAD(GND) U18.5(GND) U18.EPAD(GND) U19.5(GND) U19.EPAD(GND) U20.5(GND) U20.EPAD(GND) U23.5(GND) U23.EPAD(GND) U24.5(GND) U24.EPAD(GND) ; also sheet 1,2,3,5,6,7,8,10
N$10: R73.1 U18.6(ASEL)
N$38: R75.1 U24.6(ASEL)
N$76: R78.1 U23.6(ASEL)
N$423: R74.1 U20.6(ASEL)
N$615: R76.1 U19.6(ASEL)
N$807: R77.1 U17.6(ASEL)
N_VE [power]: R54.2 U20.4(SENSE2-) ; also sheet 7
N_VE': R54.1 U20.3(SENSE2+) ; also sheet 8
N_VN [power]: R53.2 U20.2(SENSE1-) ; also sheet 7
N_VN': R53.1 U20.1(SENSE1+) ; also sheet 8
N_VW [power]: R52.2 U18.4(SENSE2-) ; also sheet 7
N_VW': R52.1 U18.3(SENSE2+) ; also sheet 8
PCIE_VCCIO: R61.2 U23.2(SENSE1-)
PMOD_SCL: U17.9(SMCLK) U18.9(SMCLK) U19.9(SMCLK) U20.9(SMCLK) U23.9(SMCLK) U24.9(SMCLK) ; also sheet 5,6,7,8,10
PMOD_SDA: U17.8(SMDATA) U18.8(SMDATA) U19.8(SMDATA) U20.8(SMDATA) U23.8(SMDATA) U24.8(SMDATA) ; also sheet 5,6,7,8,10
S_VE [power]: R58.2 U19.4(SENSE2-) ; also sheet 7
S_VE': R58.1 U19.3(SENSE2+) ; also sheet 8
S_VS [power]: R59.2 U17.2(SENSE1-) ; also sheet 7
S_VS': R59.1 U17.1(SENSE1+) ; also sheet 8
S_VW [power]: R60.2 U17.4(SENSE2-) ; also sheet 7
S_VW': R60.1 U17.3(SENSE2+) ; also sheet 8
VCC [power]: U17.10(VDD) U18.10(VDD) U19.10(VDD) U20.10(VDD) U23.10(VDD) U24.10(VDD) ; also sheet 3,5,6,7,8,10
VCCIO [power]: R55.1 R56.1 R61.1 R62.1 U23.1(SENSE1+) U23.3(SENSE2+) U24.1(SENSE1+) U24.3(SENSE2+) ; also sheet 5,10
VCCO_13 [power]: R56.2 U24.4(SENSE2-) ; also sheet 1
VCCO_34 [power]: R62.2 U23.4(SENSE2-) ; also sheet 1
VCCO_35 [power]: R55.2 U24.2(SENSE1-) ; also sheet 1
W_VW [power]: R51.2 U18.2(SENSE1-) ; also sheet 7
W_VW' [power]: R51.1 U18.1(SENSE1+) ; also sheet 8
Unconnected: U17.7(!ALERT) U18.7(!ALERT) U19.7(!ALERT) U20.7(!ALERT) U23.7(!ALERT) U24.7(!ALERT)

### Notes on the sheet
- [0x4A] | [0x4B] | [0x48]
- [0x4C] | [0x4D] | [0x49]
- AXIOM Beta Power Board
- Sensor Power Sensing
- Copyright (C) 2014-2020 H.Poetzl
  Licensed under CERN OHL v.1.2

## Sheet 10 of 10
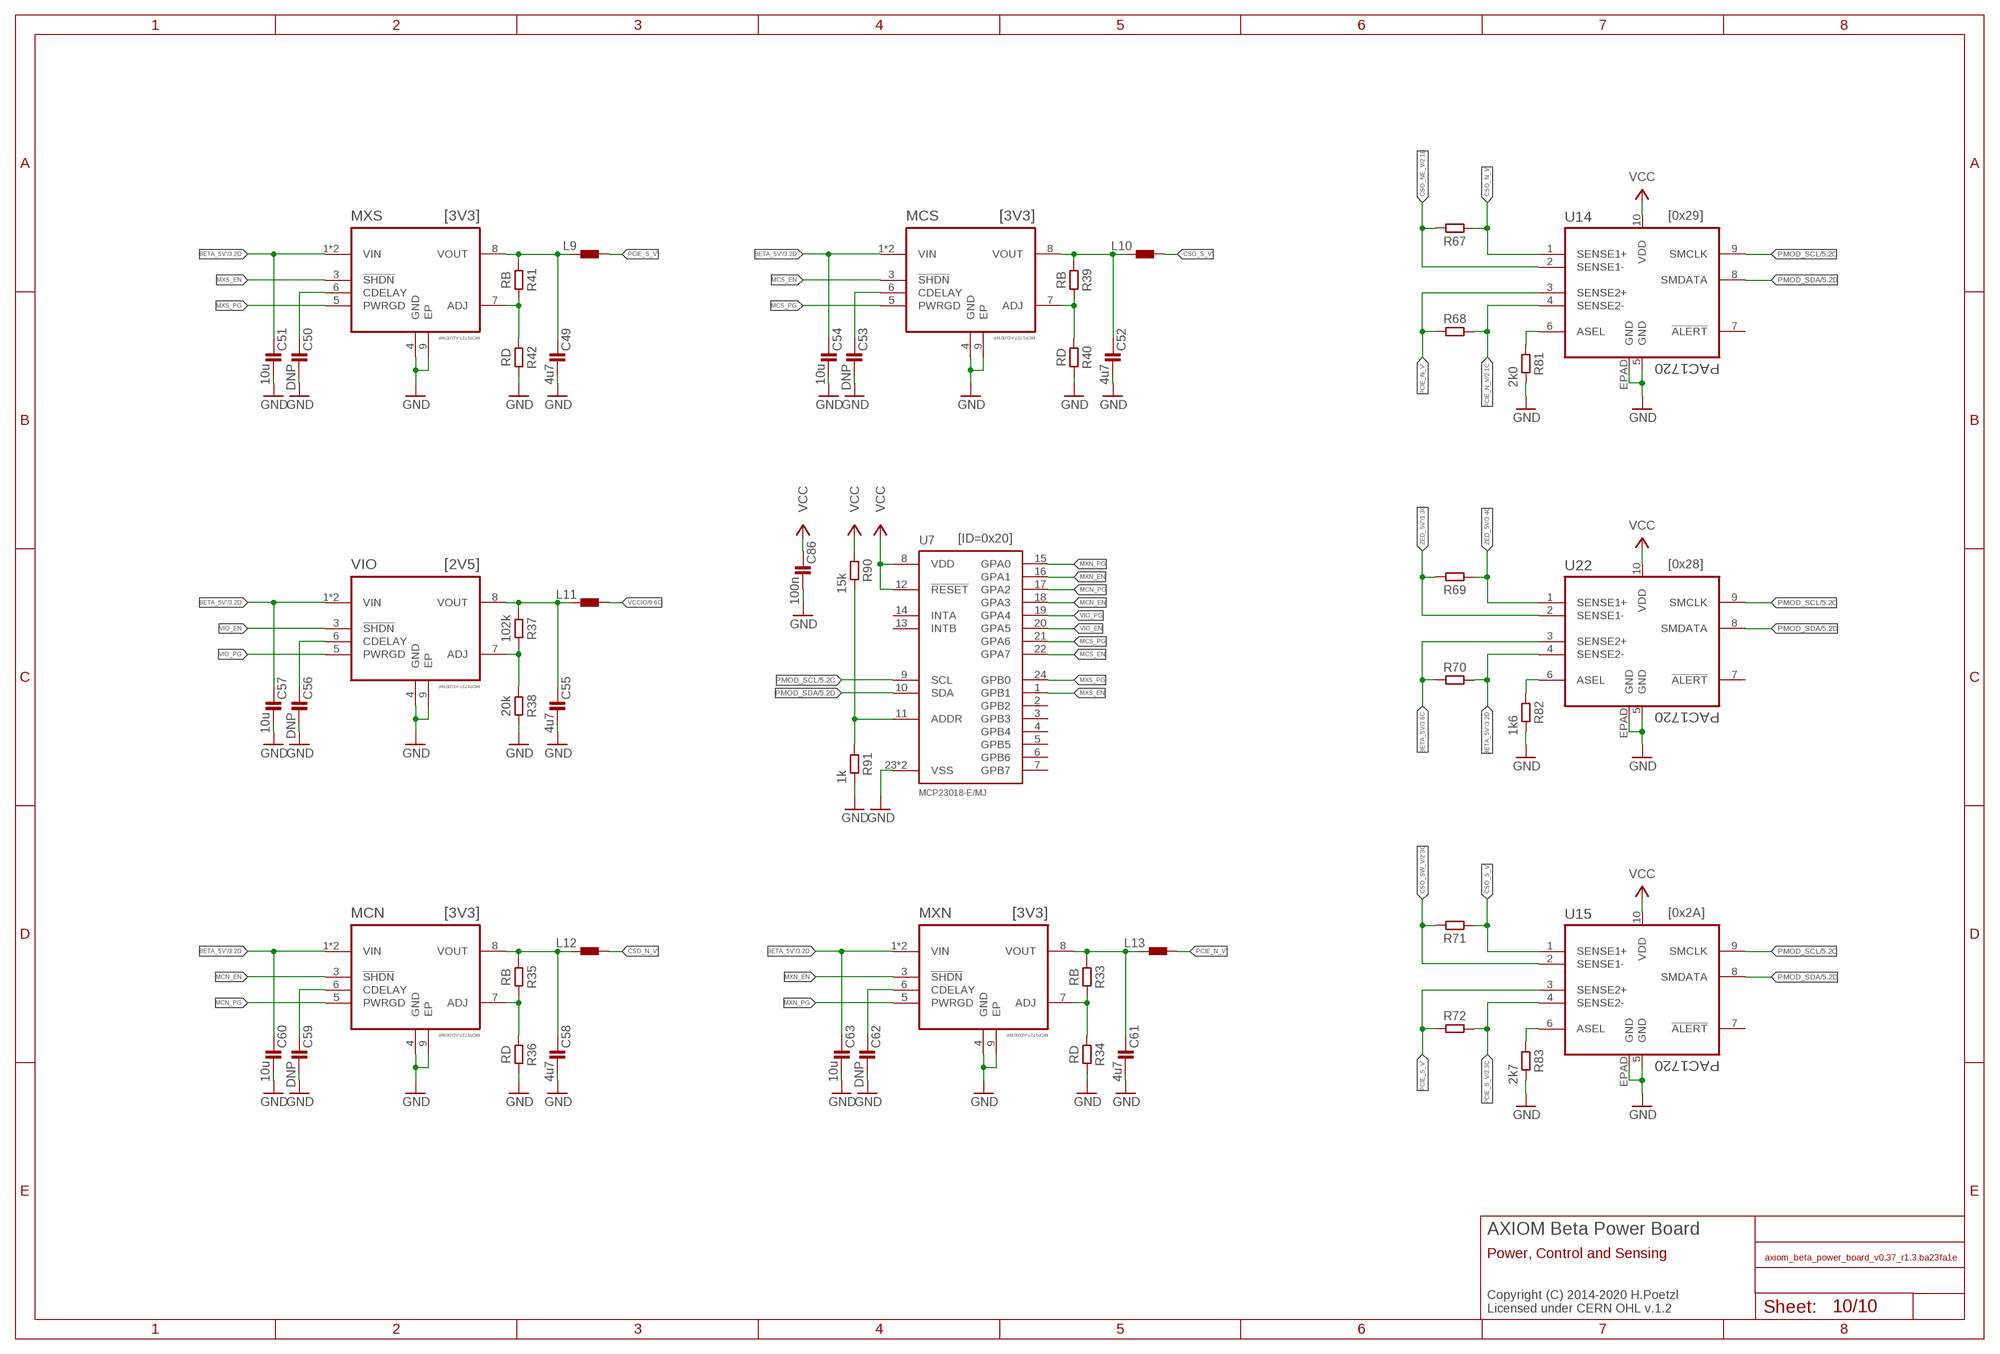
[diagram p9: schematic, sheet 10]

### Parts
C49  4u7  C0603-B  [0603-B]
C50  DNP  C0402-B  [0402-B]  (not fitted in variant Min)  (not fitted in variant Tele)
C51  10u  C0603-B  [0603-B]
C52  4u7  C0603-B  [0603-B]
C53  DNP  C0402-B  [0402-B]  (not fitted in variant Min)  (not fitted in variant Tele)
C54  10u  C0603-B  [0603-B]
C55  4u7  C0603-B  [0603-B]
C56  DNP  C0402-B  [0402-B]  (not fitted in variant Min)  (not fitted in variant Tele)
C57  10u  C0603-B  [0603-B]
C58  4u7  C0603-B  [0603-B]
C59  DNP  C0402-B  [0402-B]  (not fitted in variant Min)  (not fitted in variant Tele)
C60  10u  C0603-B  [0603-B]
C61  4u7  C0603-B  [0603-B]
C62  DNP  C0402-B  [0402-B]  (not fitted in variant Min)  (not fitted in variant Tele)
C63  10u  C0603-B  [0603-B]
C86  100n  C0402-B  [0402-B]
L9  L0805-A  [0805-A]
L10  L0805-A  [0805-A]
L11  L0805-A  [0805-A]
L12  L0805-A  [0805-A]
L13  L0805-A  [0805-A]
MCN  MCP1727-ADJE/MF  [DFN65P300X300X100-9N]
MCS  MCP1727-ADJE/MF  [DFN65P300X300X100-9N]
MXN  MCP1727-ADJE/MF  [DFN65P300X300X100-9N]
MXS  MCP1727-ADJE/MF  [DFN65P300X300X100-9N]
R33  RB  R0402-B  [0402-B]  (variant Tele: 180k)
R34  RD  R0402-B  [0402-B]  (variant Tele: 25k5)
R35  RB  R0402-B  [0402-B]  (variant Tele: 180k)
R36  RD  R0402-B  [0402-B]  (variant Tele: 25k5)
R37  102k  R0402-B  [0402-B]
R38  20k  R0402-B  [0402-B]
R39  RB  R0402-B  [0402-B]  (variant Tele: 180k)
R40  RD  R0402-B  [0402-B]  (variant Tele: 25k5)
R41  RB  R0402-B  [0402-B]  (variant Tele: 180k)
R42  RD  R0402-B  [0402-B]  (variant Tele: 25k5)
R67  R1206-B  [1206-B]
R68  R1206-B  [1206-B]
R69  R1206-B  [1206-B]
R70  R1206-B  [1206-B]
R71  R1206-B  [1206-B]
R72  R1206-B  [1206-B]
R81  2k0  R0402-B  [0402-B]
R82  1k6  R0402-B  [0402-B]
R83  2k7  R0402-B  [0402-B]
R90  15k  R0402-B  [0402-B]
R91  1k  R0402-B  [0402-B]
U7  MCP23018-E/MJ  MCP23018QFN  [QFN50P400X400X80-25N]
U14  PAC1720  [DFN3X3_10LEAD]
U15  PAC1720  [DFN3X3_10LEAD]
U22  PAC1720  [DFN3X3_10LEAD]
VIO  MCP1727-ADJE/MF  [DFN65P300X300X100-9N]

### Nets
BETA_5V [power]: R70.1 U22.3(SENSE2+) ; also sheet 3,5
BETA_5V' [power]: C51.1 C54.1 C57.1 C60.1 C63.1 MCN.1(VIN) MCN.2(VIN) MCS.1(VIN) MCS.2(VIN) MXN.1(VIN) MXN.2(VIN) MXS.1(VIN) MXS.2(VIN) R70.2 U22.4(SENSE2-) VIO.1(VIN) VIO.2(VIN) ; also sheet 3,6,7,8
CSO_N_V' [power]: L12.2 R67.1 U14.1(SENSE1+)
CSO_NE_V [power]: R67.2 U14.2(SENSE1-) ; also sheet 2
CSO_S_V' [power]: L10.2 R71.1 U15.1(SENSE1+)
CSO_SW_V [power]: R71.2 U15.2(SENSE1-) ; also sheet 2
GND: C49.2 C50.2 C51.2 C52.2 C53.2 C54.2 C55.2 C56.2 C57.2 C58.2 C59.2 C60.2 C61.2 C62.2 C63.2 C86.2 MCN.4(GND) MCN.9(EP) MCS.4(GND) MCS.9(EP) MXN.4(GND) MXN.9(EP) MXS.4(GND) MXS.9(EP) R34.2 R36.2 R38.2 R40.2 R42.2 R81.2 R82.2 R83.2 R91.2 U7.23(VSS) U7.25(VSS) U14.5(GND) U14.EPAD(GND) U15.5(GND) U15.EPAD(GND) U22.5(GND) U22.EPAD(GND) VIO.4(GND) VIO.9(EP) ; also sheet 1,2,3,5,6,7,8,9
MCN_EN: MCN.3(!SHDN) U7.18(GPA3)
MCN_PG: MCN.5(PWRGD) U7.17(GPA2)
MCS_EN: MCS.3(!SHDN) U7.22(GPA7)
MCS_PG: MCS.5(PWRGD) U7.21(GPA6)
MXN_EN: MXN.3(!SHDN) U7.16(GPA1)
MXN_PG: MXN.5(PWRGD) U7.15(GPA0)
MXS_EN: MXS.3(!SHDN) U7.1(GPB1)
MXS_PG: MXS.5(PWRGD) U7.24(GPB0)
N$1: C49.1 L9.1 MXS.8(VOUT) R41.1
N$46: MXS.7(ADJ) R41.2 R42.1
N$47: C50.1 MXS.6(CDELAY)
N$1023: R81.1 U14.6(ASEL)
N$1945: R83.1 U15.6(ASEL)
N$3234: C52.1 L10.1 MCS.8(VOUT) R39.1
N$3235: MCS.7(ADJ) R39.2 R40.1
N$3236: C53.1 MCS.6(CDELAY)
N$3240: R82.1 U22.6(ASEL)
N$3425: C55.1 L11.1 R37.1 VIO.8(VOUT)
N$3426: R37.2 R38.1 VIO.7(ADJ)
N$3427: C56.1 VIO.6(CDELAY)
N$3616: C58.1 L12.1 MCN.8(VOUT) R35.1
N$3617: MCN.7(ADJ) R35.2 R36.1
N$3618: C59.1 MCN.6(CDELAY)
N$3807: C61.1 L13.1 MXN.8(VOUT) R33.1
N$3808: MXN.7(ADJ) R33.2 R34.1
N$3809: C62.1 MXN.6(CDELAY)
N$4041: R90.2 R91.1 U7.11(ADDR)
PCIE_N_V [power]: R68.2 U14.4(SENSE2-) ; also sheet 2
PCIE_N_V' [power]: L13.2 R68.1 U14.3(SENSE2+)
PCIE_S_V [power]: R72.2 U15.4(SENSE2-) ; also sheet 2
PCIE_S_V' [power]: L9.2 R72.1 U15.3(SENSE2+)
PMOD_SCL: U7.9(SCL) U14.9(SMCLK) U15.9(SMCLK) U22.9(SMCLK) ; also sheet 5,6,7,8,9
PMOD_SDA: U7.10(SDA) U14.8(SMDATA) U15.8(SMDATA) U22.8(SMDATA) ; also sheet 5,6,7,8,9
VCC [power]: C86.1 R90.1 U7.8(VDD) U7.12(!RESET) U14.10(VDD) U15.10(VDD) U22.10(VDD) ; also sheet 3,5,6,7,8,9
VCCIO [power]: L11.2 ; also sheet 5,9
VIO_EN: U7.20(GPA5) VIO.3(!SHDN)
VIO_PG: U7.19(GPA4) VIO.5(PWRGD)
ZED_5V [power]: R69.1 U22.1(SENSE1+) ; also sheet 3,5
ZED_5V' [power]: R69.2 U22.2(SENSE1-) ; also sheet 1
Unconnected: U7.2(GPB2) U7.3(GPB3) U7.4(GPB4) U7.5(GPB5) U7.6(GPB6) U7.7(GPB7) U7.13(INTB) U7.14(INTA) U14.7(!ALERT) U15.7(!ALERT) U22.7(!ALERT)

### Notes on the sheet
- [3V3] | [3V3] | [0x29]
- [ID=0x20]
- [2V5] | [0x28]
- [3V3] | [3V3] | [0x2A]
- AXIOM Beta Power Board
- Power, Control and Sensing
- Copyright (C) 2014-2020 H.Poetzl
  Licensed under CERN OHL v.1.2

## Library data of the parts
BETA ZED = microzed:µZ-FCI
C1-C69 C73-C93 = generic-rcl:C
C70 = generic-rcl:C; CAPACITANCE: >=1u, <=22u
C71 = generic-rcl:C; CAPACITANCE: <=100n
C72 = generic-rcl:C; CAPACITANCE: >=1u, >=C70
CNW CSE = spx3819:SPX3819M5-L: 500mA, LOW-NOISE LDO VOLTAGE REGULATOR; MPN: SPX3819M5-L; OC_FARNELL: 1831948; OC_NEWARK: 23R9689; PACKAGE: SOT-23-5; SUPPLIER: EXAR
D1 = pmeg2010beld:PMEG2010BELD
EE IOE IOW MCN MCS MXN MXS NE NN NW RFE RFW SE SS SW VIO WW = mcp1727:MCP1727-ADJE/MF: IC, 1.5A, ADJ,Low Voltage, Low Quiescent Current LDO Regulator,DFN-8; MPN: MCP1727-ADJE/MF; OC_FARNELL: 1851979; OC_NEWARK: 74K5374; PACKAGE: DFN-8; SUPPLIER: Microchip
FB1 = generic-rcl:FB
FID1-FID8 = fiducial:FIDUCIAL: Fiducials
JX1B JX1T JX2B JX2T = microzed:BERGSTAK
L1-L18 = generic-rcl:L
PB-NW PB-SE = df12:DF12(XX)-20DP-0.5V
PWR-NE PWR-NW PWR-SE PWR-SW = pincon:PINRC-2X04: WR-PHD 2.54mm SMT Dual Socket Header Bottom Entry, 8 Pins=>Code : Con_BTB_SHD_2.54_2_610008243021 <http://katalog.we-online.de/media/images/eican/Con_BTB_SHD_2.54_2_6100xx243021_pf2.jpg> Details see: http://katalog.we-online.de/en/em/610_0xx_243_021 Created 2014-05-30, Karrer Zheng 2014 (C) Würth Elektronik
Q1 = transistor:NX3008N: 30 V, single N-channel Trench MOSFET Herbert Poetzl
R1-R130 = generic-rcl:R
S/N = serialnumber:91658
SD1 = micro-sd:MICRO-SD-2CD
TR1-TR8 = paul:PVZ2A
U1 = pic16f15386:PIC16F15325
U2 U3 = TPS82130:TPS82130SIL: 3-A 17V Step-down Converter Module with Integrated Inductor Source: Datasheet <http://www.ti.com/lit/gpn/tps82130>
U4 U5 U25 U30 = lvltrans:PCA9306: Bidirectional low voltage translator,SOIC-8
U6-U9 = microchip-exp:MCP23018: http://ww1.microchip.com/downloads/en/DeviceDoc/22103a.pdf Source: http://ww1.microchip.com/downloads/en/DeviceDoc/22103a.pdf Adopted by RobG
U10-U13 = ldo:LDO_DUAL: Dual Output SOT23-6 Linear Regulators Diodes Inc. AP7312 - Dual 150mA LDO Linear Regulator 0.2V dropout, 150mA output, 2-6V Input AP7312-1833W6-7 - 1.8V/3.3V SOT23-6 (Digikey: AP7312-1833W6-7DICT-ND) MIC5320 - Dual 150mA ULDO Linear Regulator Ultra-low 35mV dropout at 150mA, 2.3-5.5V Input 3.3V/1.8V SOT23-6 (Digikey: 576-1658-1-ND) 3.3V/1.5V SOT23-6 (Digikey: 576-3483-1-ND)
U14-U24 = pac1720:PAC1720
U26 = SC202A:SC202A
U27 = ts3a4751:TS3A4751-BLOCK
U28 = emifil:IP4251CZ16-8-TTL: passive filter network; MPN: IP4251CZ16-8-TTL; OC_FARNELL: 1972684; OC_NEWARK: 58T9585; PACKAGE: SON-16; SUPPLIER: NXP
U29 = lm75:LM75: Digital temperature sensor and thermal watchdog
U31 = ldo:NCP715
VP+ VP- = testpad:TP: Test pad
X1 = pico-spox:PICO-SPOX-5
X2 = pinhead-2:PINHD-2X02: PIN HEADER

## Net classes
1 LVDS: width 0.152 mm, drill 0.203 mm, clearance 0.152 mm
2 power: width 0.254 mm, drill 0.254 mm, clearance 0.152 mm